# EAGLE design LE (EAGLE 7.2.0)

## Sheet 1 of 5
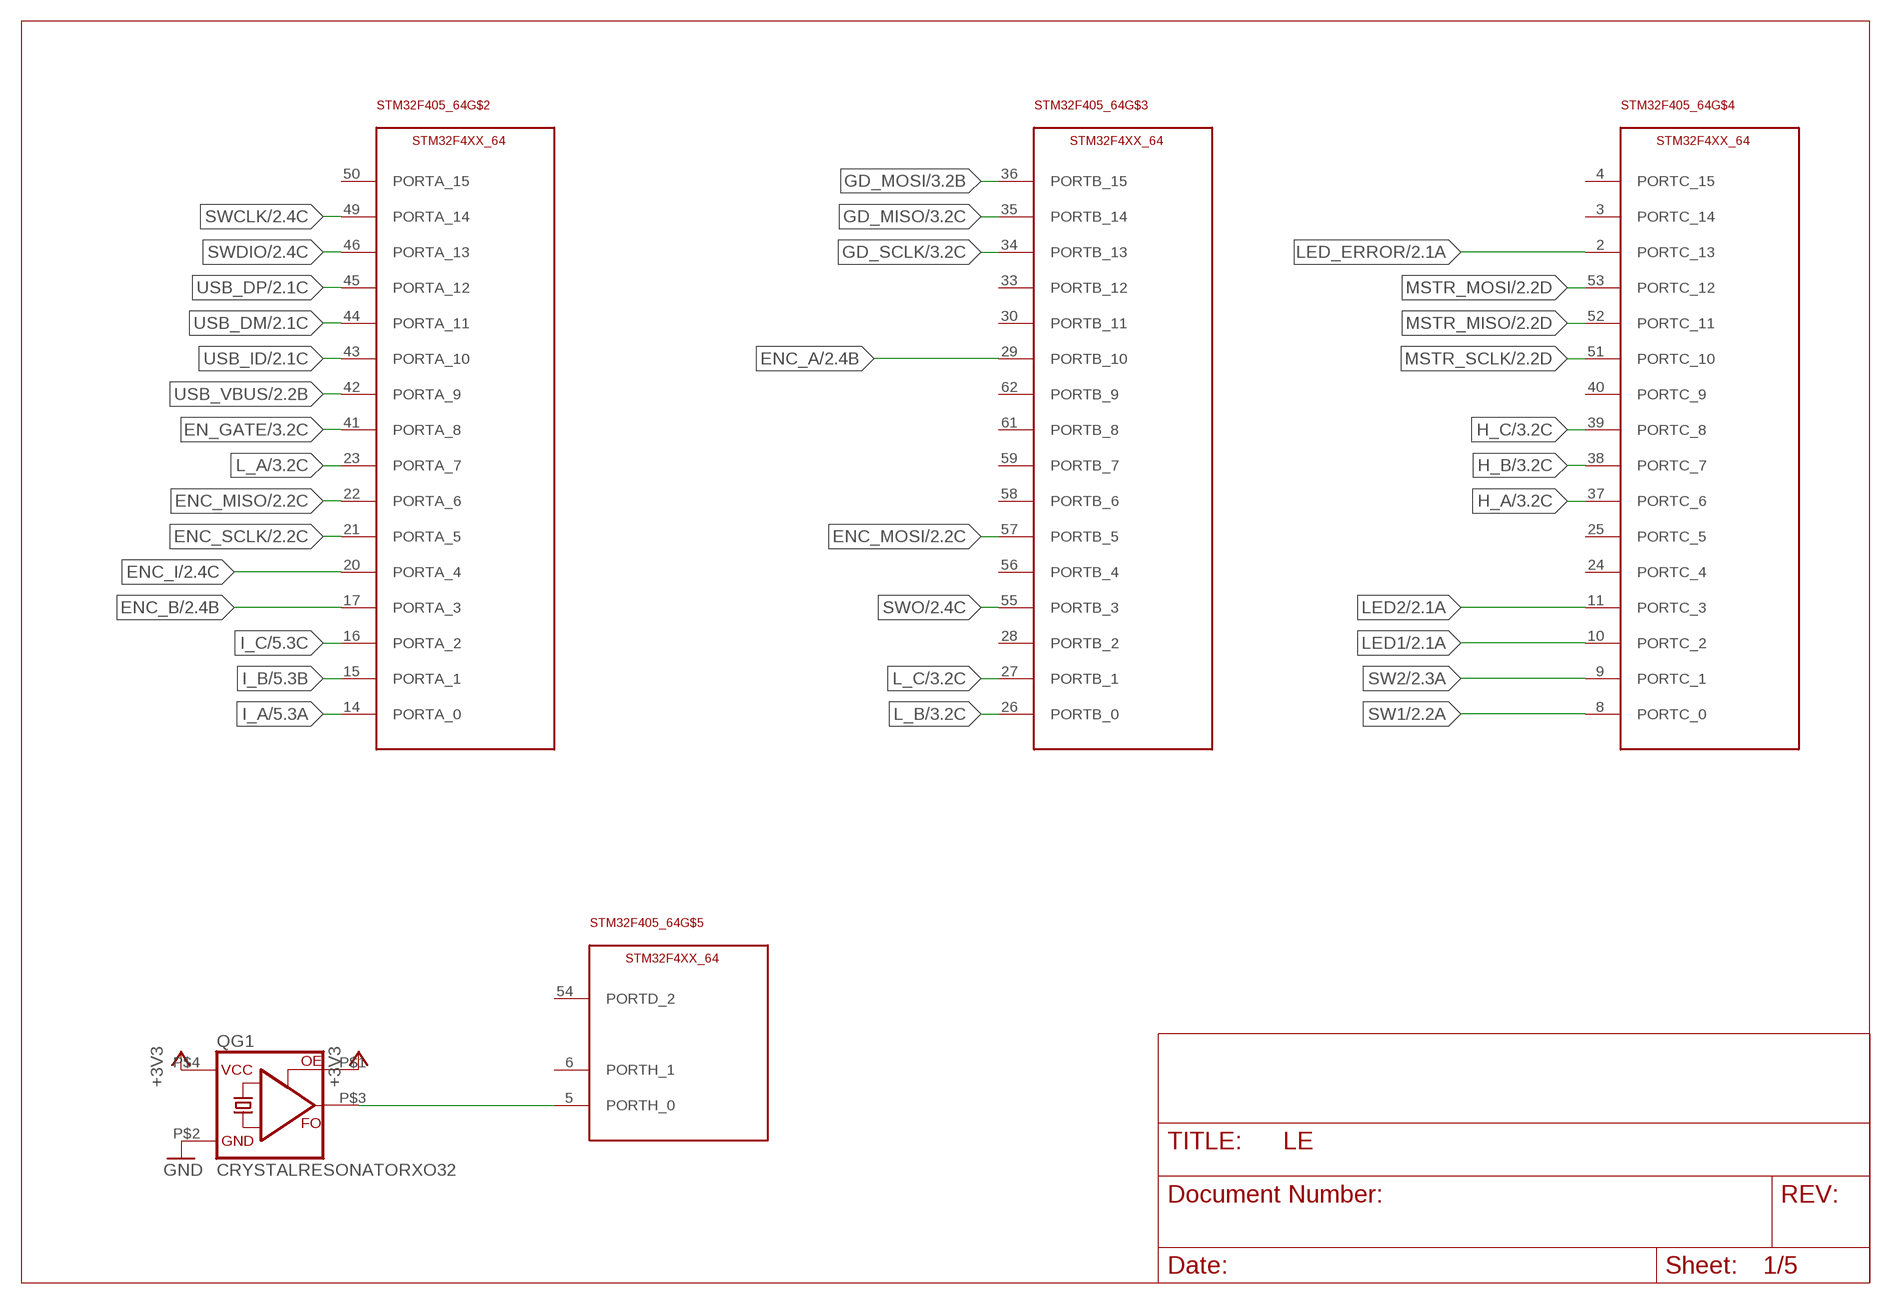
[diagram p0: schematic, sheet 1]

### Parts
QG1  CRYSTALRESONATORXO32  [XO32]
STM32F405_64  STM32F4XX_64  [TQFP64]

### Nets
+3V3: QG1.P$1(OE) QG1.P$4(VCC) ; also sheet 2,3
EN_GATE: STM32F405_64.41(PORTA_8) ; also sheet 3
ENC_A: STM32F405_64.29(PORTB_10) ; also sheet 2
ENC_B: STM32F405_64.17(PORTA_3) ; also sheet 2
ENC_I: STM32F405_64.20(PORTA_4) ; also sheet 2
ENC_MISO: STM32F405_64.22(PORTA_6) ; also sheet 2
ENC_MOSI: STM32F405_64.57(PORTB_5) ; also sheet 2
ENC_SCLK: STM32F405_64.21(PORTA_5) ; also sheet 2
GD_MISO: STM32F405_64.35(PORTB_14) ; also sheet 3
GD_MOSI: STM32F405_64.36(PORTB_15) ; also sheet 3
GD_SCLK: STM32F405_64.34(PORTB_13) ; also sheet 3
GND: QG1.P$2(GND) ; also sheet 2,3,4,5
H_A: STM32F405_64.37(PORTC_6) ; also sheet 3
H_B: STM32F405_64.38(PORTC_7) ; also sheet 3
H_C: STM32F405_64.39(PORTC_8) ; also sheet 3
I_A: STM32F405_64.14(PORTA_0) ; also sheet 5
I_B: STM32F405_64.15(PORTA_1) ; also sheet 5
I_C: STM32F405_64.16(PORTA_2) ; also sheet 5
L_A: STM32F405_64.23(PORTA_7) ; also sheet 3
L_B: STM32F405_64.26(PORTB_0) ; also sheet 3
L_C: STM32F405_64.27(PORTB_1) ; also sheet 3
LED1: STM32F405_64.10(PORTC_2) ; also sheet 2
LED2: STM32F405_64.11(PORTC_3) ; also sheet 2
LED_ERROR: STM32F405_64.2(PORTC_13) ; also sheet 2
MSTR_MISO: STM32F405_64.52(PORTC_11) ; also sheet 2
MSTR_MOSI: STM32F405_64.53(PORTC_12) ; also sheet 2
MSTR_SCLK: STM32F405_64.51(PORTC_10) ; also sheet 2
N$30: QG1.P$3(FO) STM32F405_64.5(PORTH_0)
SW1: STM32F405_64.8(PORTC_0) ; also sheet 2
SW2: STM32F405_64.9(PORTC_1) ; also sheet 2
SWCLK: STM32F405_64.49(PORTA_14) ; also sheet 2
SWDIO: STM32F405_64.46(PORTA_13) ; also sheet 2
SWO: STM32F405_64.55(PORTB_3) ; also sheet 2
USB_DM: STM32F405_64.44(PORTA_11) ; also sheet 2
USB_DP: STM32F405_64.45(PORTA_12) ; also sheet 2
USB_ID: STM32F405_64.43(PORTA_10) ; also sheet 2
USB_VBUS: STM32F405_64.42(PORTA_9) ; also sheet 2
Unconnected: STM32F405_64.3(PORTC_14) STM32F405_64.4(PORTC_15) STM32F405_64.6(PORTH_1) STM32F405_64.24(PORTC_4) STM32F405_64.25(PORTC_5) STM32F405_64.28(PORTB_2) STM32F405_64.30(PORTB_11) STM32F405_64.33(PORTB_12) STM32F405_64.40(PORTC_9) STM32F405_64.50(PORTA_15) STM32F405_64.54(PORTD_2) STM32F405_64.56(PORTB_4) STM32F405_64.58(PORTB_6) STM32F405_64.59(PORTB_7) STM32F405_64.61(PORTB_8) STM32F405_64.62(PORTB_9)

## Sheet 2 of 5
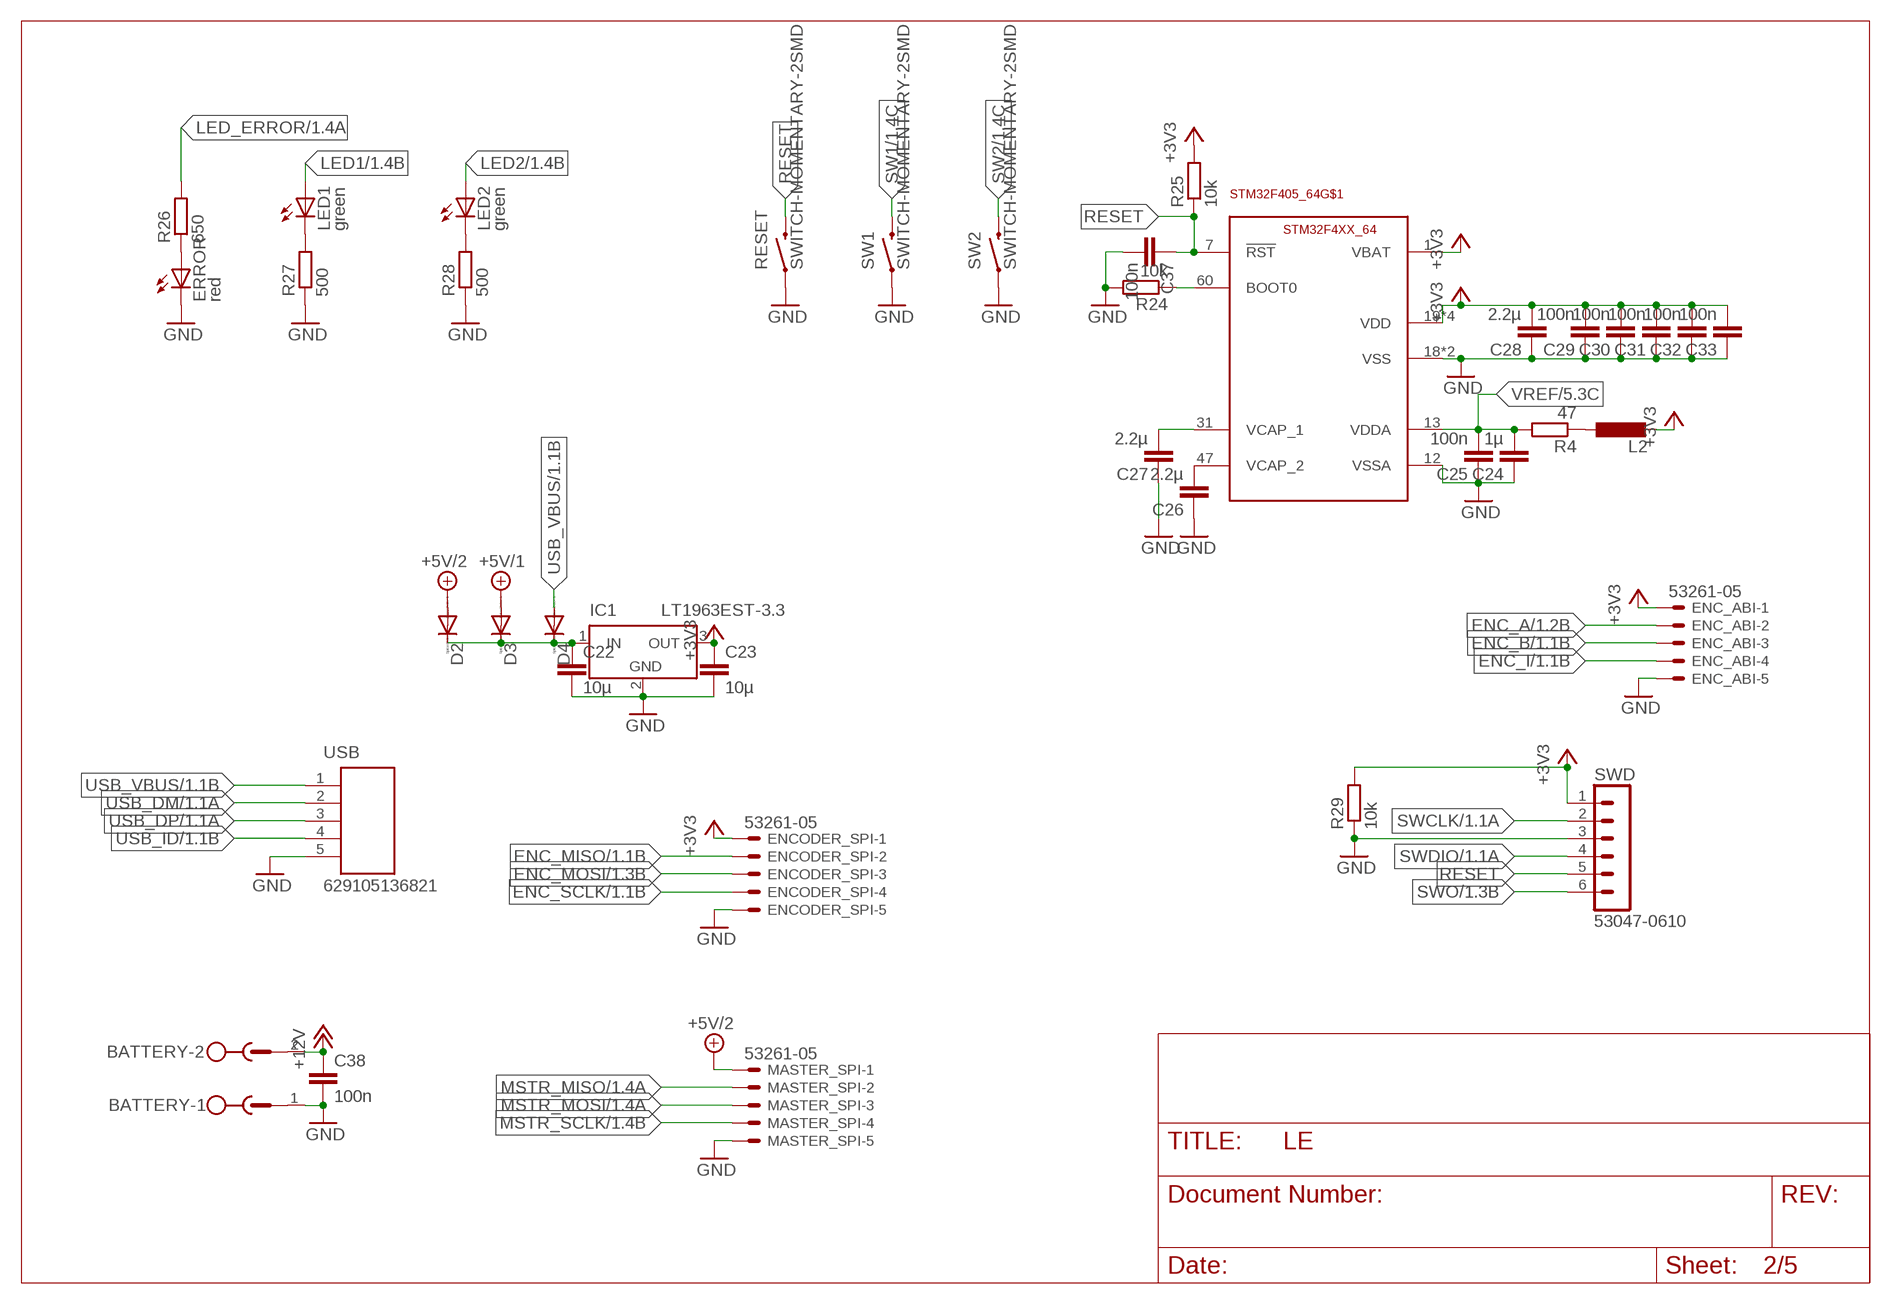
[diagram p1: schematic, sheet 2]

### Parts
BATTERY  MSTBV2  [MSTBV2]
C22  10µ  C-EUC0805  [C0805]
C23  10µ  C-EUC0805  [C0805]
C24  1µ  C-EUC0805  [C0805]
C25  100n  C-EUC0805  [C0805]
C26  2.2µ  C-EUC0805  [C0805]
C27  2.2µ  C-EUC0805  [C0805]
C28  2.2µ  C-EUC0805  [C0805]
C29  100n  C-EUC0805  [C0805]
C30  100n  C-EUC0805  [C0805]
C31  100n  C-EUC0805  [C0805]
C32  100n  C-EUC0805  [C0805]
C33  100n  C-EUC0805  [C0805]
C37  100n  C-EUC0805  [C0805]
C38  100n  C-EUC0805  [C0805]
D2  DIODE-DO214AC  [DO214AC]
D3  DIODE-DO214AC  [DO214AC]
D4  DIODE-DO214AC  [DO214AC]
ENC_ABI  53261-05  [53261-05]
ENCODER_SPI  53261-05  [53261-05]
ERROR  red  LEDCHIP-LED0805  [CHIP-LED0805]
IC1  LT1963EST-3.3  [SOT223]
L2  L-EUL2012C  [L2012C]
LED1  green  LEDCHIP-LED0805  [CHIP-LED0805]
LED2  green  LEDCHIP-LED0805  [CHIP-LED0805]
MASTER_SPI  53261-05  [53261-05]
R4  47  R-EU_R0805  [R0805]
R24  10k  R-EU_R0805  [R0805]
R25  10k  R-EU_R0805  [R0805]
R26  650  R-EU_R0805  [R0805]
R27  500  R-EU_R0805  [R0805]
R28  500  R-EU_R0805  [R0805]
R29  10k  R-EU_R0805  [R0805]
RESET  SWITCH-MOMENTARY-2SMD  [TACTILE-SWITCH-SMD]
SW1  SWITCH-MOMENTARY-2SMD  [TACTILE-SWITCH-SMD]
SW2  SWITCH-MOMENTARY-2SMD  [TACTILE-SWITCH-SMD]
SWD  53047-0610  [53047-0610]
USB  629105136821  [629105136821]

### Nets
+3V3: C23.1 C28.2 C29.2 C30.2 C31.2 C32.2 C33.2 ENC_ABI.1 ENCODER_SPI.1 IC1.3(OUT) L2.2 R25.2 R29.2 STM32F405_64.1(VBAT) STM32F405_64.19(VDD) STM32F405_64.32(VDD) STM32F405_64.48(VDD) STM32F405_64.64(VDD) SWD.1 ; also sheet 1,3
+5V/1: D3.A ; also sheet 3
+5V/2: D2.A MASTER_SPI.1
+12V: BATTERY.2 C38.1 ; also sheet 3,4
ENC_A: ENC_ABI.2 ; also sheet 1
ENC_B: ENC_ABI.3 ; also sheet 1
ENC_I: ENC_ABI.4 ; also sheet 1
ENC_MISO: ENCODER_SPI.2 ; also sheet 1
ENC_MOSI: ENCODER_SPI.3 ; also sheet 1
ENC_SCLK: ENCODER_SPI.4 ; also sheet 1
GND: BATTERY.1 C22.2 C23.2 C24.1 C25.1 C26.1 C27.1 C28.1 C29.1 C30.1 C31.1 C32.1 C33.1 C37.2 C38.2 ENC_ABI.5 ENCODER_SPI.5 ERROR.C IC1.2(GND) MASTER_SPI.5 R24.2 R27.1 R28.1 R29.1 RESET.1 STM32F405_64.12(VSSA) STM32F405_64.18(VSS) STM32F405_64.63(VSS) SW1.1 SW2.1 SWD.3 USB.5 ; also sheet 1,3,4,5
LED1: LED1.A ; also sheet 1
LED2: LED2.A ; also sheet 1
LED_ERROR: R26.2 ; also sheet 1
MSTR_MISO: MASTER_SPI.2 ; also sheet 1
MSTR_MOSI: MASTER_SPI.3 ; also sheet 1
MSTR_SCLK: MASTER_SPI.4 ; also sheet 1
N$1: L2.1 R4.1
N$3: C26.2 STM32F405_64.47(VCAP_2)
N$4: C27.2 STM32F405_64.31(VCAP_1)
N$7: LED1.C R27.2
N$8: C22.1 D2.C D3.C D4.C IC1.1(IN)
N$28: LED2.C R28.2
N$31: R24.1 STM32F405_64.60(BOOT0)
N$33: ERROR.A R26.1
RESET: C37.1 R25.1 RESET.3 STM32F405_64.7(!RST) SWD.5
SW1: SW1.3 ; also sheet 1
SW2: SW2.3 ; also sheet 1
SWCLK: SWD.2 ; also sheet 1
SWDIO: SWD.4 ; also sheet 1
SWO: SWD.6 ; also sheet 1
USB_DM: USB.2 ; also sheet 1
USB_DP: USB.3 ; also sheet 1
USB_ID: USB.4 ; also sheet 1
USB_VBUS: D4.A USB.1 ; also sheet 1
VREF: C24.2 C25.2 R4.2 STM32F405_64.13(VDDA) ; also sheet 5

## Sheet 3 of 5
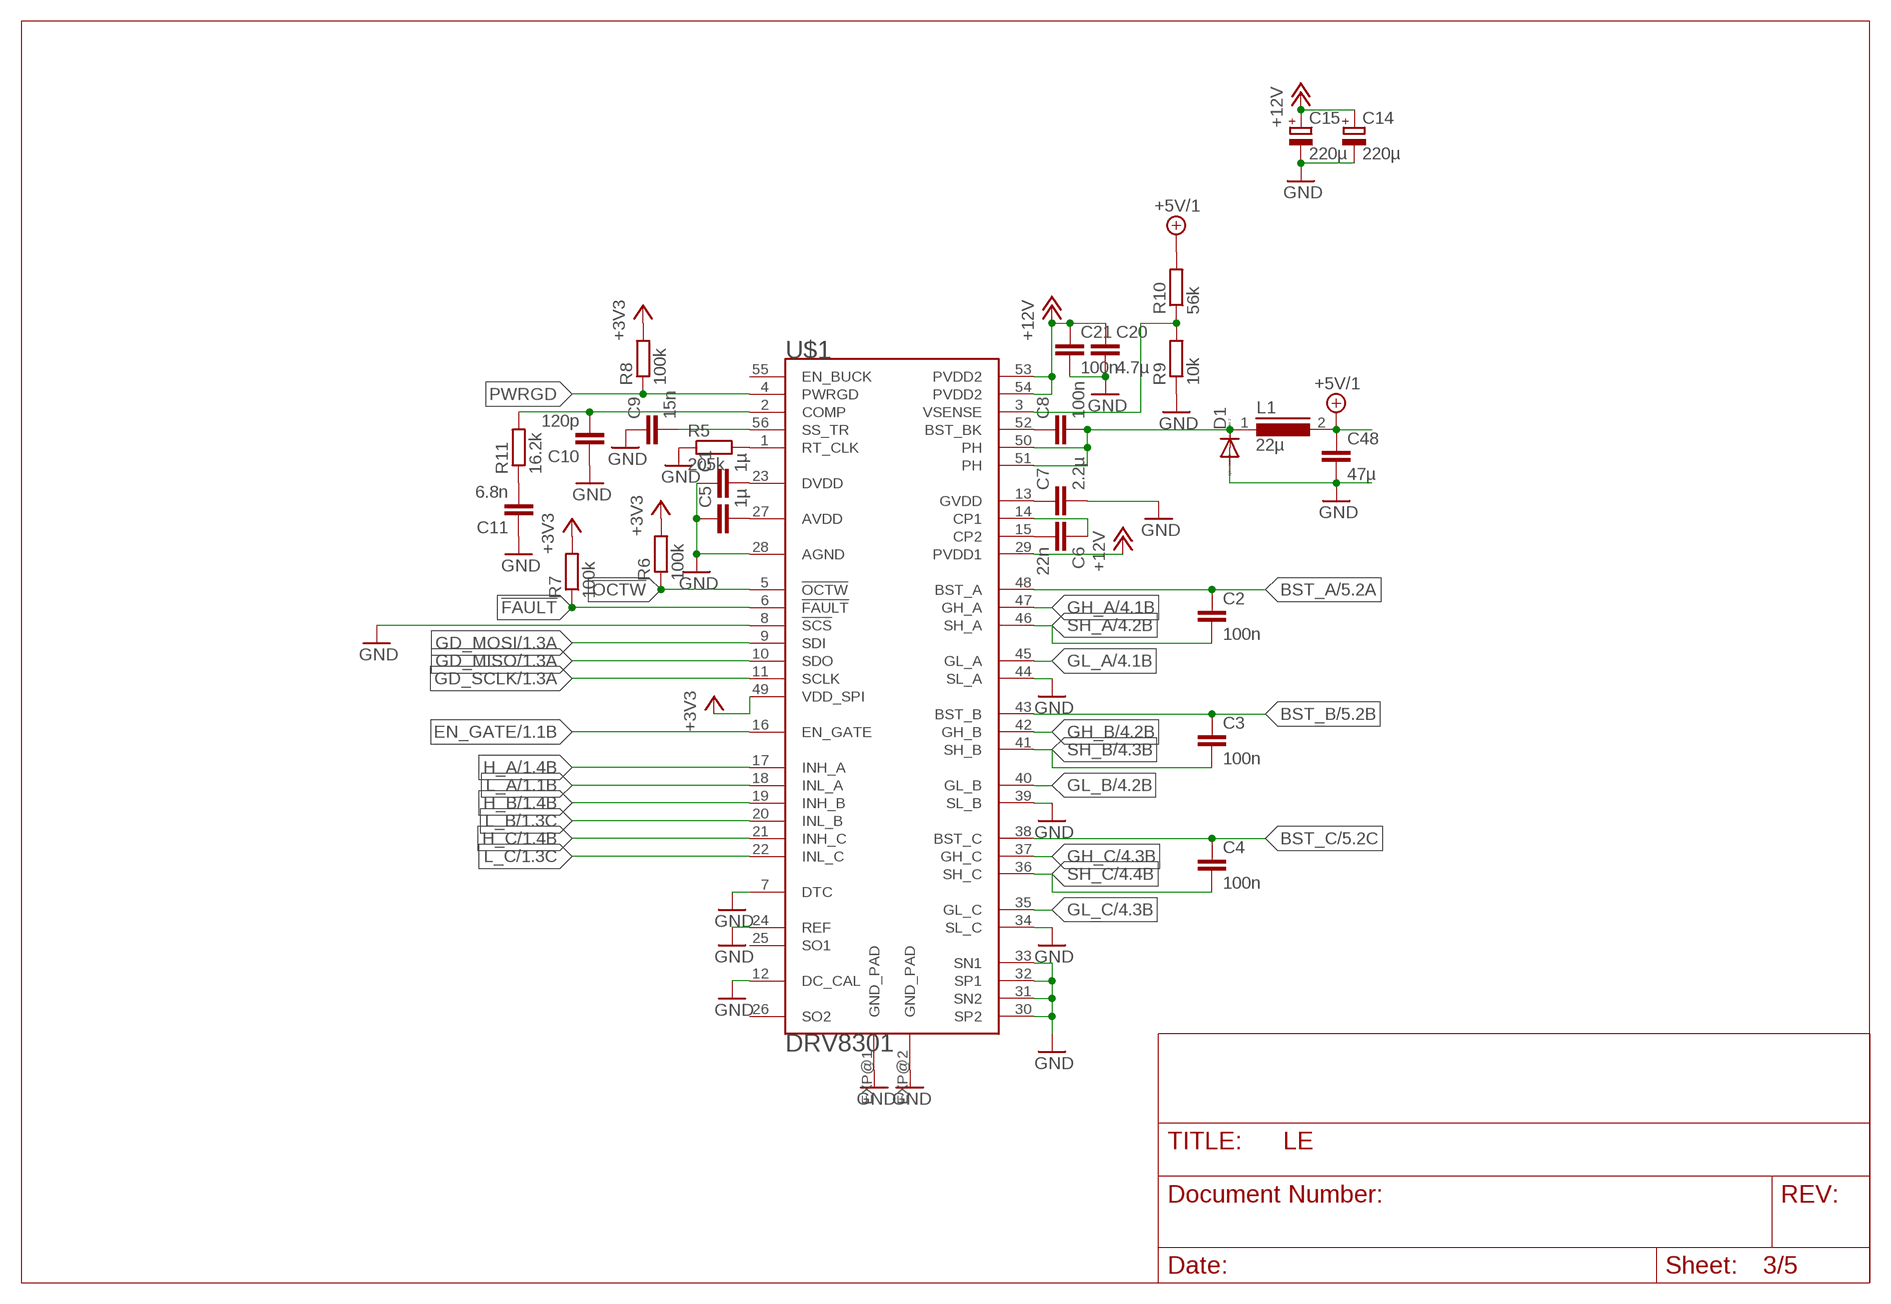
[diagram p2: schematic, sheet 3]

### Parts
C1  1µ  C-EUC0805  [C0805]
C2  100n  C-EUC0805  [C0805]
C3  100n  C-EUC0805  [C0805]
C4  100n  C-EUC0805  [C0805]
C5  1µ  C-EUC0805  [C0805]
C6  22n  C-EUC0805  [C0805]
C7  2.2µ  C-EUC0805  [C0805]
C8  100n  C-EUC0805  [C0805]
C9  15n  C-EUC0805  [C0805]
C10  120p  C-EUC0805  [C0805]
C11  6.8n  C-EUC0805  [C0805]
C14  220µ  CPOL-EUG  [PANASONIC_G]
C15  220µ  CPOL-EUG  [PANASONIC_G]
C20  4.7µ  C-EUC0805  [C0805]
C21  100n  C-EUC0805  [C0805]
C48  47µ  C-EUC1206  [C1206]
D1  DIODE-DO-214AC  [DO-214AC]
L1  22µ  DR127  [DR127]
R5  205k  R-EU_R0805  [R0805]
R6  100k  R-EU_R0805  [R0805]
R7  100k  R-EU_R0805  [R0805]
R8  100k  R-EU_R0805  [R0805]
R9  10k  R-EU_R0805  [R0805]
R10  56k  R-EU_R0805  [R0805]
R11  16.2k  R-EU_R0805  [R0805]
U$1  DRV8301  [HTSSOP56DCA]

### Nets
!FAULT: R7.1 U$1.6(!FAULT)
!OCTW: R6.1 U$1.5(!OCTW)
+3V3: R6.2 R7.2 R8.2 U$1.49(VDD_SPI) ; also sheet 1,2
+5V/1: C48.1 L1.2 R10.2 ; also sheet 2
+12V: C14.+ C15.+ C20.1 C21.1 U$1.29(PVDD1) U$1.53(PVDD2) U$1.54(PVDD2) ; also sheet 2,4
BST_A: C2.1 U$1.48(BST_A) ; also sheet 5
BST_B: C3.1 U$1.43(BST_B) ; also sheet 5
BST_C: C4.1 U$1.38(BST_C) ; also sheet 5
EN_GATE: U$1.16(EN_GATE) ; also sheet 1
GD_MISO: U$1.10(SDO) ; also sheet 1
GD_MOSI: U$1.9(SDI) ; also sheet 1
GD_SCLK: U$1.11(SCLK) ; also sheet 1
GH_A: U$1.47(GH_A) ; also sheet 4
GH_B: U$1.42(GH_B) ; also sheet 4
GH_C: U$1.37(GH_C) ; also sheet 4
GL_A: U$1.45(GL_A) ; also sheet 4
GL_B: U$1.40(GL_B) ; also sheet 4
GL_C: U$1.35(GL_C) ; also sheet 4
GND: C1.1 C5.1 C7.2 C9.1 C10.1 C11.1 C14.- C15.- C20.2 C21.2 C48.2 D1.A R5.1 R9.1 U$1.7(DTC) U$1.8(!SCS) U$1.12(DC_CAL) U$1.24(REF) U$1.28(AGND) U$1.30(SP2) U$1.31(SN2) U$1.32(SP1) U$1.33(SN1) U$1.34(SL_C) U$1.39(SL_B) U$1.44(SL_A) U$1.EXP@1(GND_PAD) U$1.EXP@2(GND_PAD) ; also sheet 1,2,4,5
H_A: U$1.17(INH_A) ; also sheet 1
H_B: U$1.19(INH_B) ; also sheet 1
H_C: U$1.21(INH_C) ; also sheet 1
L_A: U$1.18(INL_A) ; also sheet 1
L_B: U$1.20(INL_B) ; also sheet 1
L_C: U$1.22(INL_C) ; also sheet 1
N$9: R5.2 U$1.1(RT_CLK)
N$10: C1.2 U$1.23(DVDD)
N$11: C5.2 U$1.27(AVDD)
N$12: C6.1 U$1.14(CP1)
N$13: C6.2 U$1.15(CP2)
N$14: C7.1 U$1.13(GVDD)
N$15: C8.1 U$1.52(BST_BK)
N$16: C8.2 D1.C L1.1 U$1.50(PH) U$1.51(PH)
N$17: C9.2 U$1.56(SS_TR)
N$18: R9.2 R10.1 U$1.3(VSENSE)
N$19: C11.2 R11.1
N$20: C10.2 R11.2 U$1.2(COMP)
PWRGD: R8.1 U$1.4(PWRGD)
SH_A: C2.2 U$1.46(SH_A) ; also sheet 4,5
SH_B: C3.2 U$1.41(SH_B) ; also sheet 4,5
SH_C: C4.2 U$1.36(SH_C) ; also sheet 4,5
Unconnected: U$1.25(SO1) U$1.26(SO2) U$1.55(EN_BUCK)

## Sheet 4 of 5
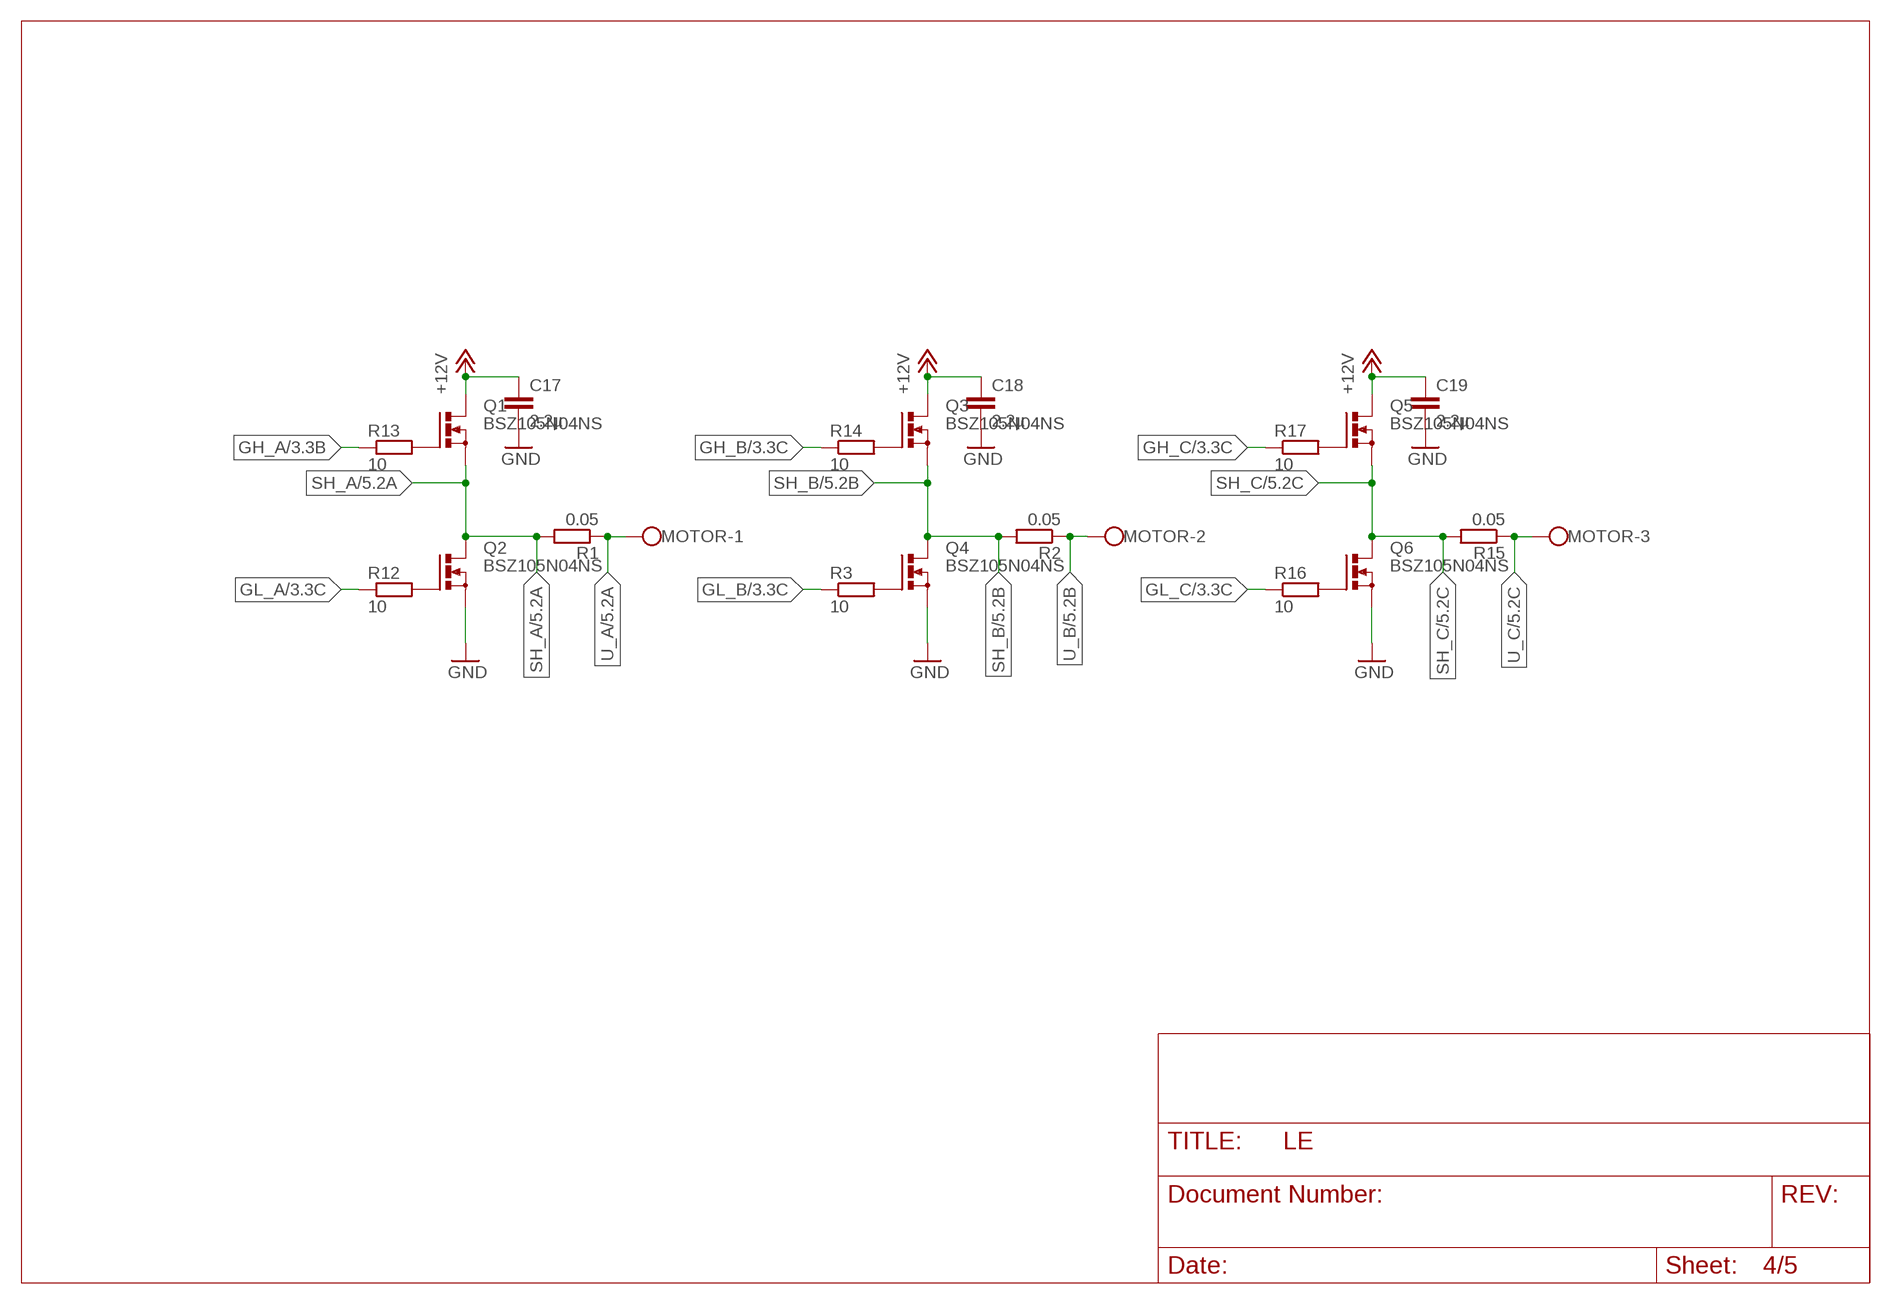
[diagram p3: schematic, sheet 4]

### Parts
C17  2.2µ  C-EUC0805  [C0805]
C18  2.2µ  C-EUC0805  [C0805]
C19  2.2µ  C-EUC0805  [C0805]
MOTOR  W237-103  [W237-103]
Q1  BSZ105N04NS  [PG-TDSON-8]
Q2  BSZ105N04NS  [PG-TDSON-8]
Q3  BSZ105N04NS  [PG-TDSON-8]
Q4  BSZ105N04NS  [PG-TDSON-8]
Q5  BSZ105N04NS  [PG-TDSON-8]
Q6  BSZ105N04NS  [PG-TDSON-8]
R1  0.05  R-EU_R1206  [R1206]
R2  0.05  R-EU_R1206  [R1206]
R3  10  R-EU_R1206  [R1206]
R12  10  R-EU_R1206  [R1206]
R13  10  R-EU_R0805  [R0805]
R14  10  R-EU_R0805  [R0805]
R15  0.05  R-EU_R1206  [R1206]
R16  10  R-EU_R1206  [R1206]
R17  10  R-EU_R0805  [R0805]

### Nets
+12V: C17.1 C18.1 C19.1 Q1.5(D) Q1.6(D) Q1.7(D) Q1.8(D) Q1.TH(D) Q3.5(D) Q3.6(D) Q3.7(D) Q3.8(D) Q3.TH(D) Q5.5(D) Q5.6(D) Q5.7(D) Q5.8(D) Q5.TH(D) ; also sheet 2,3
GH_A: R13.1 ; also sheet 3
GH_B: R14.1 ; also sheet 3
GH_C: R17.1 ; also sheet 3
GL_A: R12.1 ; also sheet 3
GL_B: R3.1 ; also sheet 3
GL_C: R16.1 ; also sheet 3
GND: C17.2 C18.2 C19.2 Q2.1(S) Q2.2(S) Q2.3(S) Q4.1(S) Q4.2(S) Q4.3(S) Q6.1(S) Q6.2(S) Q6.3(S) ; also sheet 1,2,3,5
N$6: Q3.4(G) R14.2
N$21: Q1.4(G) R13.2
N$22: Q4.4(G) R3.2
N$24: Q5.4(G) R17.2
N$25: Q6.4(G) R16.2
N$26: Q2.4(G) R12.2
SH_A: Q1.1(S) Q1.2(S) Q1.3(S) Q2.5(D) Q2.6(D) Q2.7(D) Q2.8(D) Q2.TH(D) R1.2 ; also sheet 3,5
SH_B: Q3.1(S) Q3.2(S) Q3.3(S) Q4.5(D) Q4.6(D) Q4.7(D) Q4.8(D) Q4.TH(D) R2.2 ; also sheet 3,5
SH_C: Q5.1(S) Q5.2(S) Q5.3(S) Q6.5(D) Q6.6(D) Q6.7(D) Q6.8(D) Q6.TH(D) R15.2 ; also sheet 3,5
U_A: MOTOR.1 R1.1 ; also sheet 5
U_B: MOTOR.2 R2.1 ; also sheet 5
U_C: MOTOR.3 R15.1 ; also sheet 5

## Sheet 5 of 5
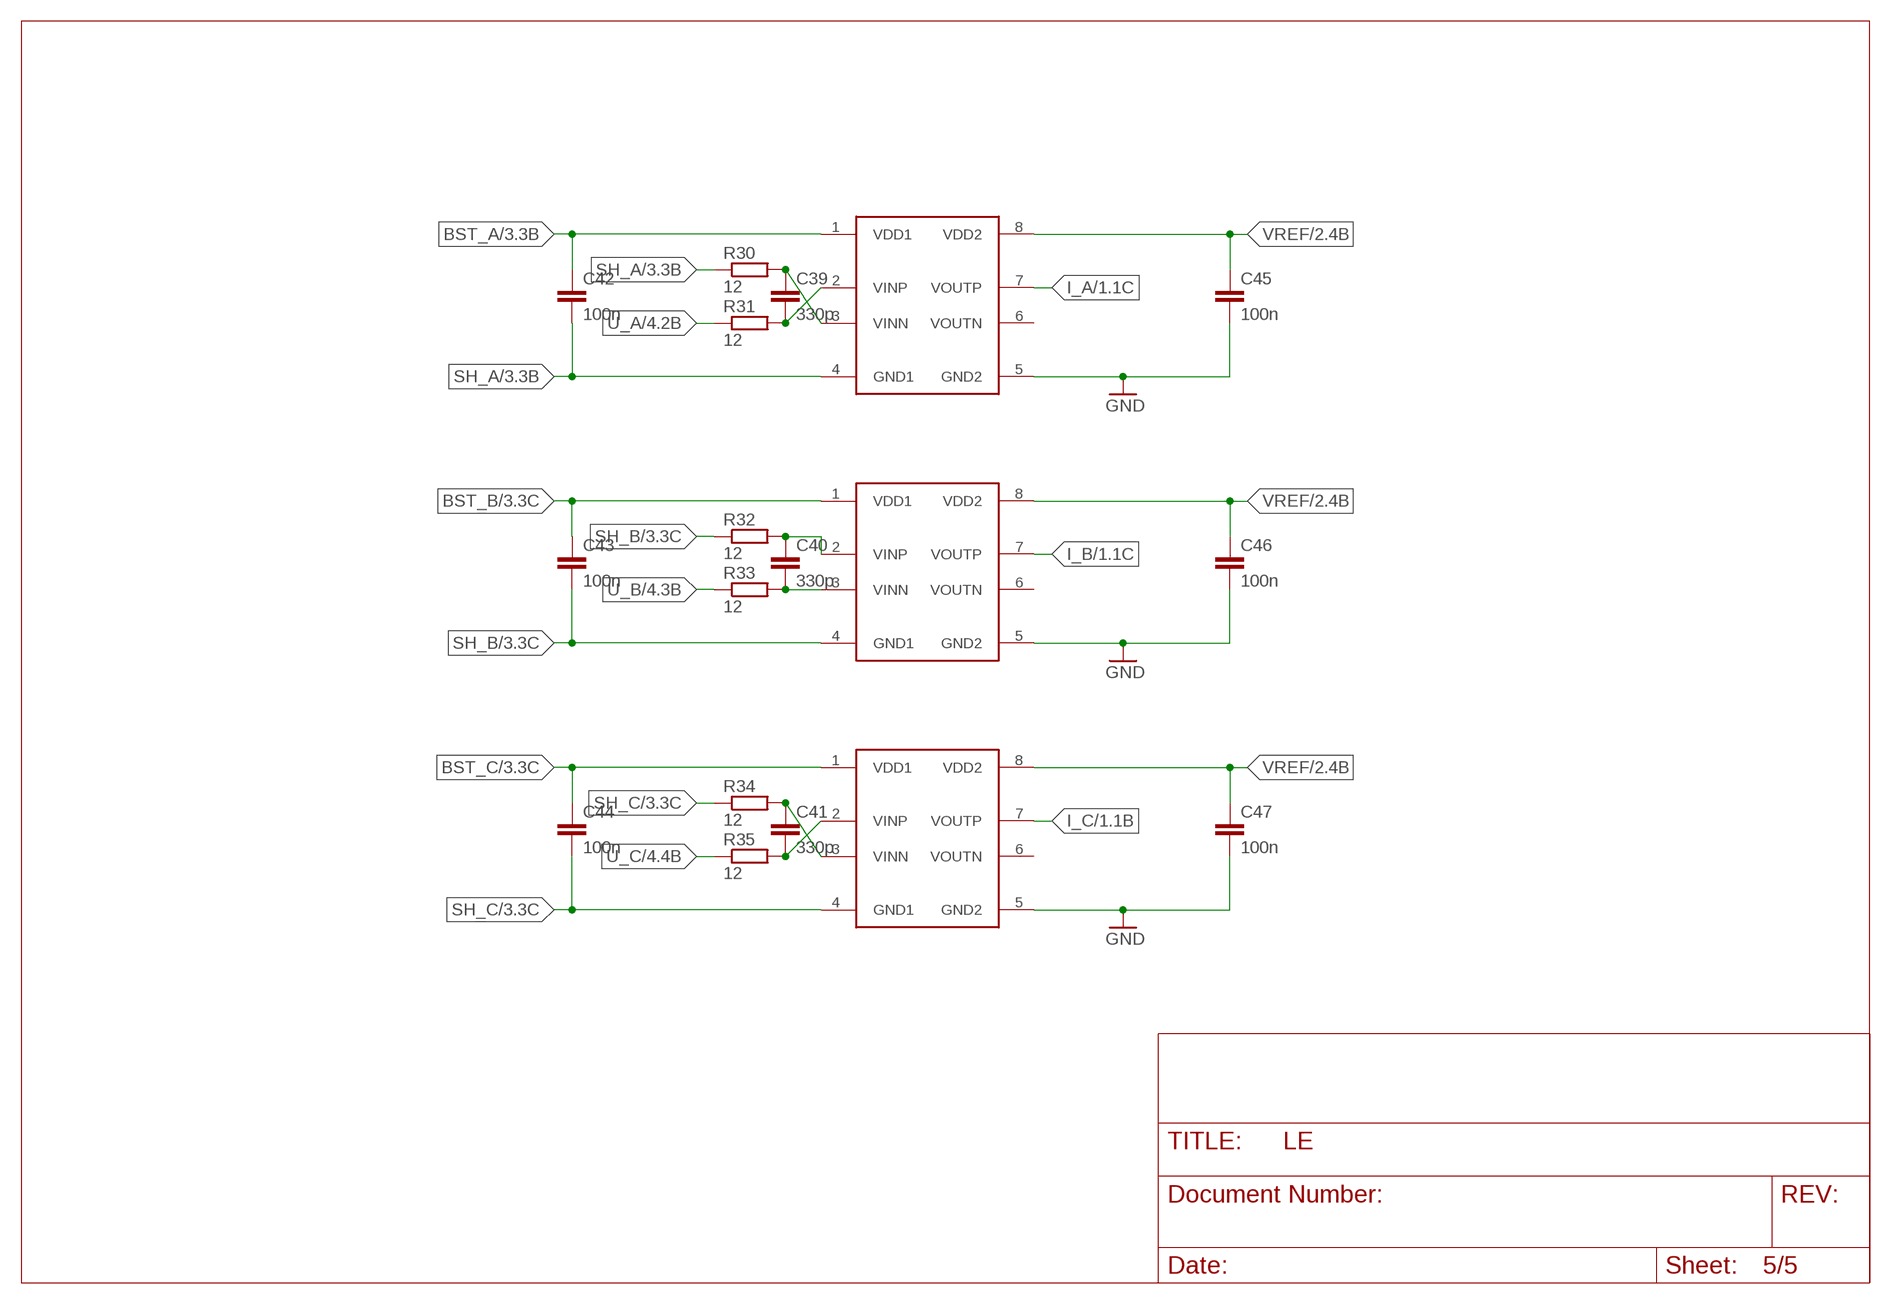
[diagram p4: schematic, sheet 5]

### Parts
C39  330p  C-EUC0805  [C0805]
C40  330p  C-EUC0805  [C0805]
C41  330p  C-EUC0805  [C0805]
C42  100n  C-EUC1206  [C1206]
C43  100n  C-EUC1206  [C1206]
C44  100n  C-EUC1206  [C1206]
C45  100n  C-EUC1206  [C1206]
C46  100n  C-EUC1206  [C1206]
C47  100n  C-EUC1206  [C1206]
R30  12  R-EU_R0805  [R0805]
R31  12  R-EU_R0805  [R0805]
R32  12  R-EU_R0805  [R0805]
R33  12  R-EU_R0805  [R0805]
R34  12  R-EU_R0805  [R0805]
R35  12  R-EU_R0805  [R0805]
U$2  AMC1200  [SOIC8]
U$3  AMC1200  [SOIC8]
U$4  AMC1200  [SOIC8]

### Nets
BST_A: C42.1 U$2.1(VDD1) ; also sheet 3
BST_B: C43.1 U$3.1(VDD1) ; also sheet 3
BST_C: C44.1 U$4.1(VDD1) ; also sheet 3
GND: C45.2 C46.2 C47.2 U$2.5(GND2) U$3.5(GND2) U$4.5(GND2) ; also sheet 1,2,3,4
I_A: U$2.7(VOUTP) ; also sheet 1
I_B: U$3.7(VOUTP) ; also sheet 1
I_C: U$4.7(VOUTP) ; also sheet 1
N$27: C39.1 R30.2 U$2.3(VINN)
N$32: C39.2 R31.2 U$2.2(VINP)
N$37: C40.2 R33.2 U$3.3(VINN)
N$38: C40.1 R32.2 U$3.2(VINP)
N$39: C41.1 R34.2 U$4.3(VINN)
N$40: C41.2 R35.2 U$4.2(VINP)
SH_A: C42.2 R30.1 U$2.4(GND1) ; also sheet 3,4
SH_B: C43.2 R32.1 U$3.4(GND1) ; also sheet 3,4
SH_C: C44.2 R34.1 U$4.4(GND1) ; also sheet 3,4
U_A: R31.1 ; also sheet 4
U_B: R33.1 ; also sheet 4
U_C: R35.1 ; also sheet 4
VREF: C45.1 C46.1 C47.1 U$2.8(VDD2) U$3.8(VDD2) U$4.8(VDD2) ; also sheet 2
Unconnected: U$2.6(VOUTN) U$3.6(VOUTN) U$4.6(VOUTN)

## Power pins joined to a net without a drawn wire
GND: IC1.4(GND)

## Library data of the parts
BATTERY = con-phoenix-500:MSTBV2: PHOENIX; OC_FARNELL: unknown; OC_NEWARK: unknown
C1-C11 C17-C33 C37-C48 = rcl:C-EU: CAPACITOR, European symbol
C14 C15 = rcl:CPOL-EU: POLARIZED CAPACITOR, European symbol
D1-D4 = diode:DIODE-: DIODE
ENC_ABI ENCODER_SPI MASTER_SPI = con-molex:53?-05: CONNECTOR wire to board 1.25 mm (.049 inch) pitch header; OC_FARNELL: 1433644; OC_NEWARK: unknown
ERROR LED1 LED2 = led:LED: LED OSRAM: - CHIPLED LG R971, LG N971, LY N971, LG Q971, LY Q971, LO R971, LY R971 LH N974, LH R974 LS Q976, LO Q976, LY Q976 LO Q996 - Hyper CHIPLED LW Q18S LB Q993, LB Q99A, LB R99A - SideLED LS A670, LO A670, LY A670, LG A670, LP A670 LB A673, LV A673, LT A673, LW A673 LH A674 LY A675 LS A676, LA A676, LO A676, LY A676, LW A676 LS A679, LY A679, LG A679 - Hyper Micro SIDELED® LS Y876, LA Y876, LO Y876, LY Y876 LT Y87S - SmartLED LW L88C, LW L88S LB L89C, LB L89S, LG L890 LS L89K, LO L89K, LY L89K LS L896, LA L896, LO L896, LY L896 - TOPLED LS T670, LO T670, LY T670, LG T670, LP T670 LSG T670, LSP T670, LSY T670, LOP T670, LYG T670 LG T671, LOG T671, LSG T671 LB T673, LV T673, LT T673, LW T673 LH T674 LS T676, LA T676, LO T676, LY T676, LB T676, LH T676, LSB T676, LW T676 LB T67C, LV T67C, LT T67C, LS T67K, LO T67K, LY T67K, LW E67C LS E67B, LA E67B, LO E67B, LY E67B, LB E67C, LV E67C, LT E67C LW T67C LS T679, LY T679, LG T679 LS T770, LO T770, LY T770, LG T770, LP T770 LB T773, LV T773, LT T773, LW T773 LH T774 LS E675, LA E675, LY E675, LS T675 LS T776, LA T776, LO T776, LY T776, LB T776 LHGB T686 LT T68C, LB T68C - Hyper Mini TOPLED® LB M676 - Mini TOPLED Santana® LG M470 LS M47K, LO M47K, LY M47K Source: http://www.osram.convergy.de LUXEON: - LUMILED® LXK2-PW12-R00, LXK2-PW12-S00, LXK2-PW14-U00, LXK2-PW14-V00 LXK2-PM12-R00, LXK2-PM12-S00, LXK2-PM14-U00 LXK2-PE12-Q00, LXK2-PE12-R00, LXK2-PE12-S00, LXK2-PE14-T00, LXK2-PE14-U00 LXK2-PB12-K00, LXK2-PB12-L00, LXK2-PB12-M00, LXK2-PB14-N00, LXK2-PB14-P00, LXK2-PB14-Q00 LXK2-PR12-L00, LXK2-PR12-M00, LXK2-PR14-Q00, LXK2-PR14-R00 LXK2-PD12-Q00, LXK2-PD12-R00, LXK2-PD12-S00 LXK2-PH12-R00, LXK2-PH12-S00 LXK2-PL12-P00, LXK2-PL12-Q00, LXK2-PL12-R00 Source: www.luxeon.com KINGBRIGHT: KA-3528ASYC Source: www.kingbright.com
IC1 = linear-technology:LT1963EST: 1.5A, Low Noise, Fast Transient Response LDO Regulator Source: http://www.linear.com/pc/downloadDocument.do?navId=H0,C3,P2222,D3148; MPN: LT1963EST-3.3; OC_FARNELL: 1501032; OC_NEWARK: 57M7546
L1 = inductors:DR127: High Power Density, High Efficiency, Shielded Inductors Source: coiltronics_dr_series.pdf
L2 = rcl:L-EU: INDUCTOR, European symbol
MOTOR = con-wago-500:W237-103: WAGO SCREW CLAMP; MPN: 237-103; OC_FARNELL: unknown; OC_NEWARK: 18M7116
Q1-Q6 = transistor-power:BSZ105N04NS: OptiMOS (TM)3 Power-Transistor N-Channel, Normal level Source : Data sheet <http://www.infineon.com/dgdl/BSZ105N04NSG_rev1.1.pdf?folderId=db3a3043156fd5730115c7d50620107c&fileId=db3a30431689f4420116c485c67f084e>
QG1 = Crystals-new:CRYSTALRESONATOR
R1-R17 R24-R35 = rcl:R-EU_: RESISTOR, European symbol
RESET SW1 SW2 = SparkFun-Electromechanical:SWITCH-MOMENTARY-2: Various NO switches- pushbuttons, reed, etc; PROD_ID: SWCH-08247
STM32F405_64 = stm32:STM32F4XX_64
SWD = con-molex-picoblade:53047-0610: HEADER
U$1 = DRV8301:DRV8301
U$2-U$4 = AMC1200:AMC1200
USB = USBSteckverbinderWR-COM:629105136821: WR-COM SMT Horizontal 5 Contacts Micro USB Type B,5 pins=>Code : Con_I-O_COM_MicroUSB_629105136821 <http://katalog.we-online.de/media/images/eican/Con_I-O_COM_MicroUSB_629105136821_pf2.jpg> Details see: http://katalog.we-online.de/en/em/629_105_136_821 Created 2014-07-09, Karrer Zheng 2014 (C) Würth Elektronik

## Board
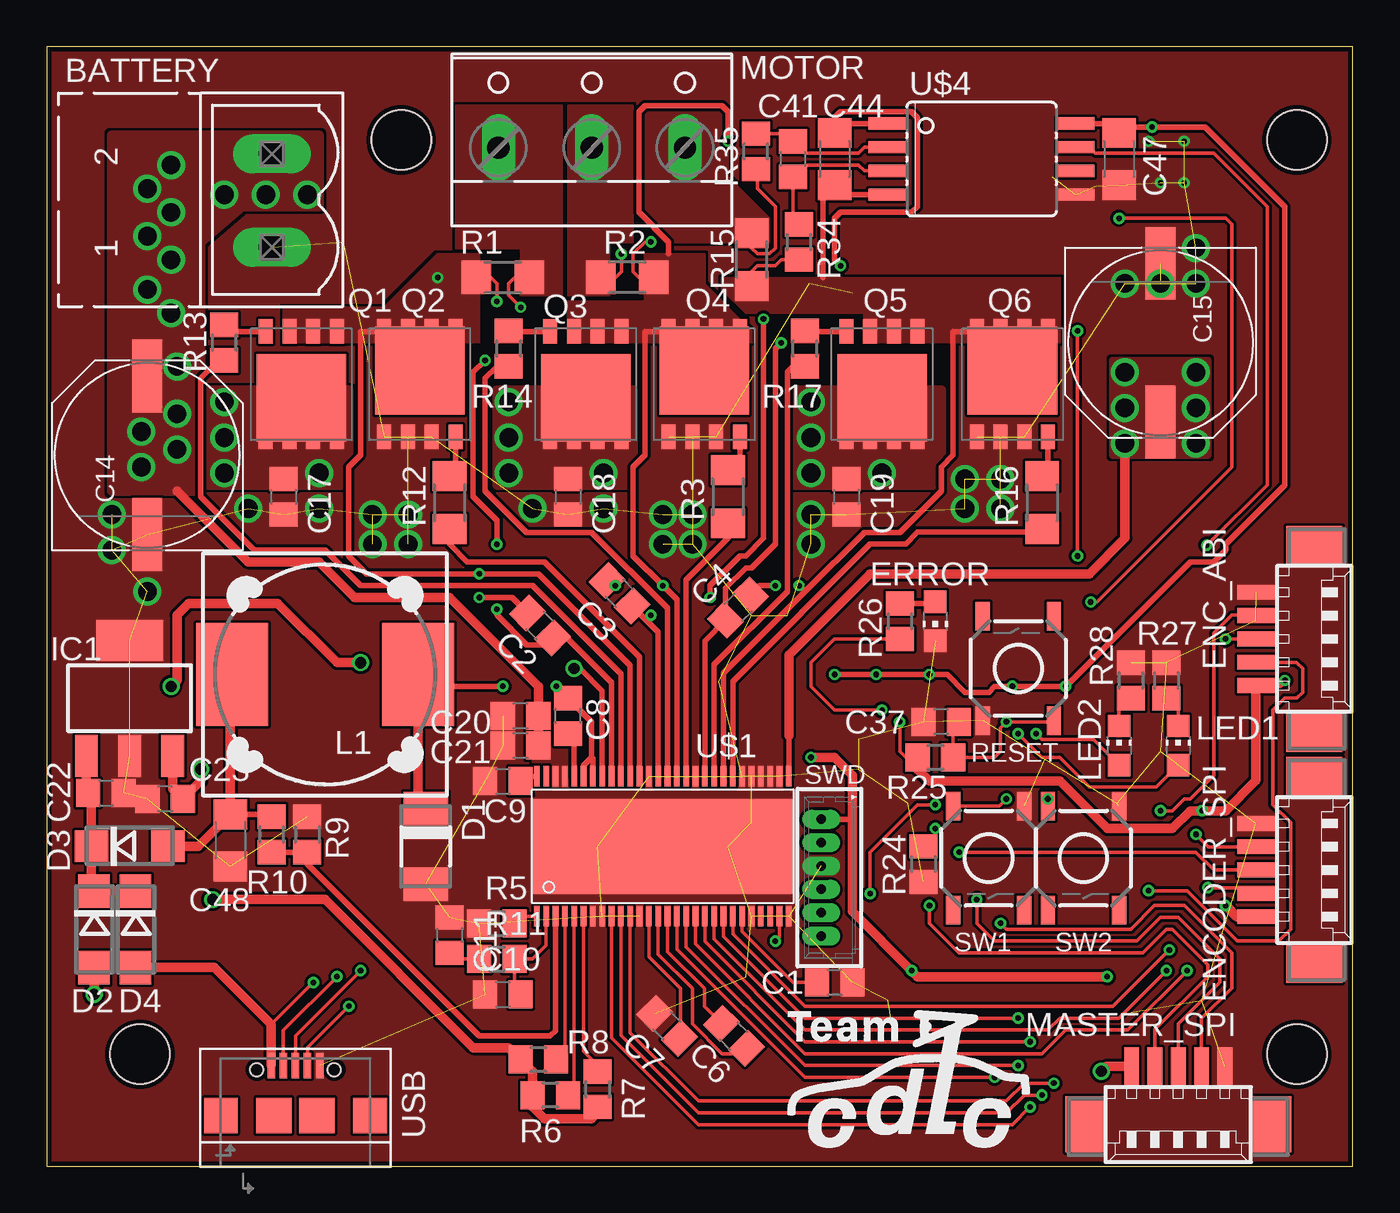
[diagram p5: board, top side]
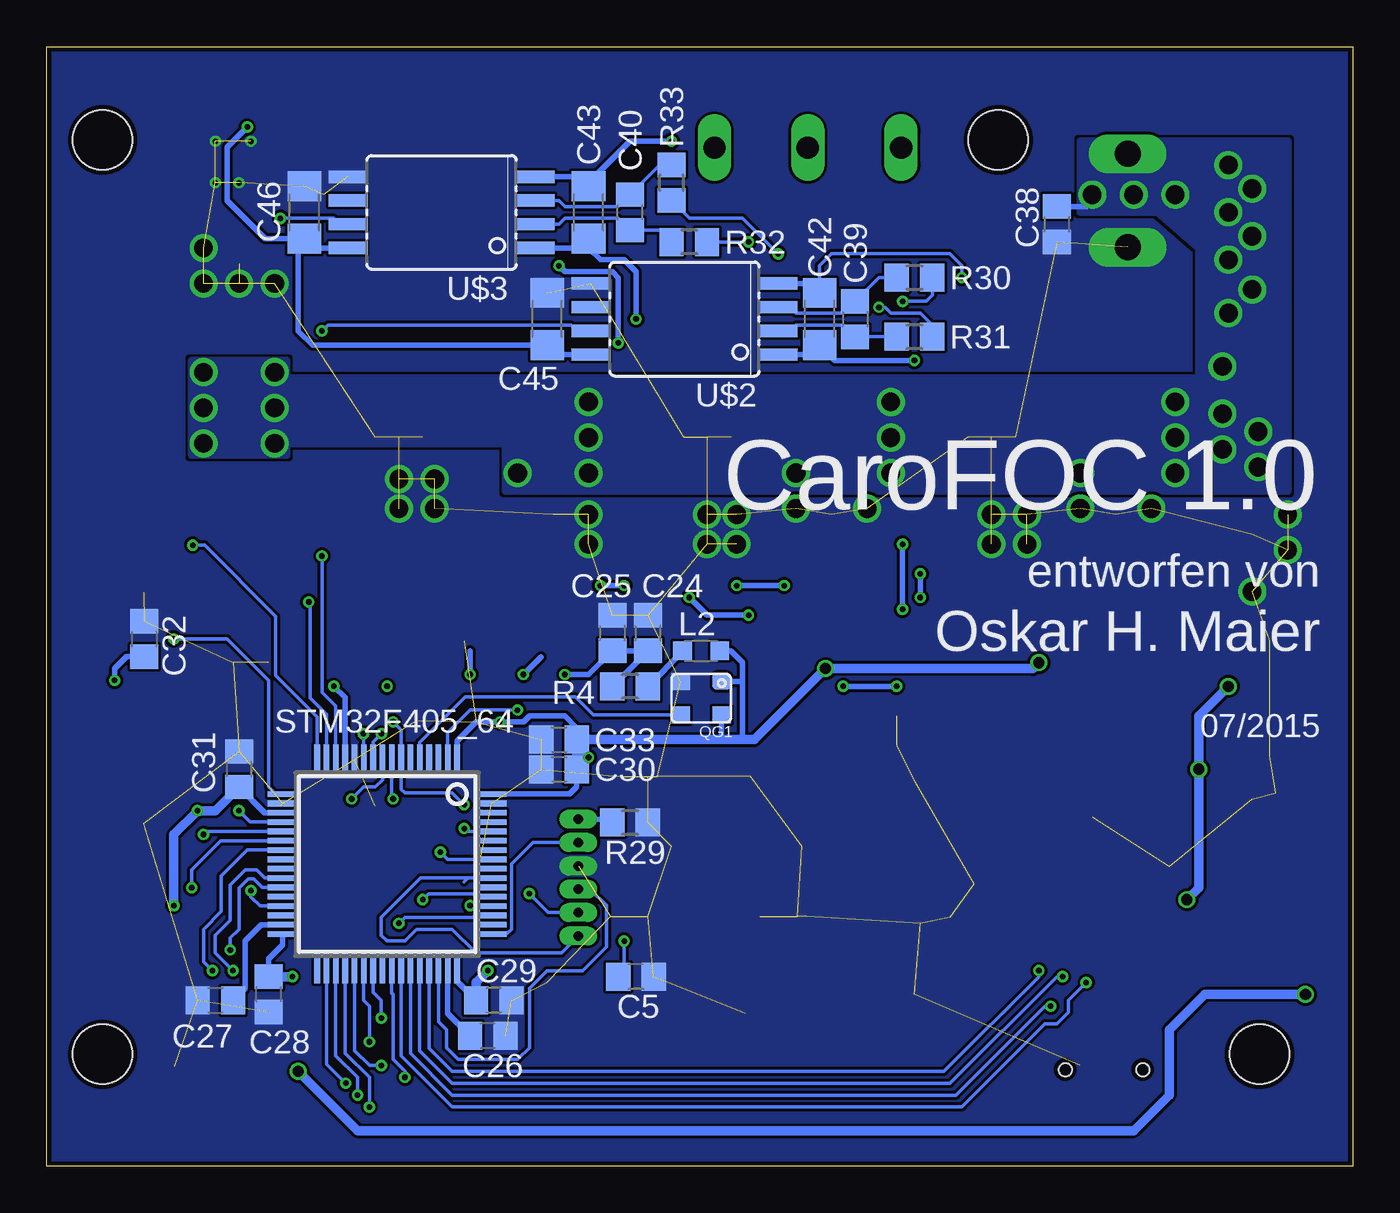
[diagram p6: board, bottom side, seen from below]

Size 70 x 60 mm. Coordinates in mm from the lower left corner, seen from the top.
Outline: 0,0 70,0 70,60 0,60 0,0
Copper layers (1*16): Top 0.035mm / dielectric 1.5mm / Bottom 0.035mm
Design rules "Elecrow_2-layer_eagle_rule *": minimum track width 6mil, minimum drill 0.3mm, track to track 6mil, track to pad 6mil, pad to pad 6mil, via to via 6mil, smd to smd 0mil, copper to edge 10mil, drill to drill 10mil, minimum pad ring 10mil, minimum via ring 6mil, stop-mask expansion 2mil, vias tented up to drill 100mil, thermal gap 10mil
Holes 3.2 mm at 5,6 67,6 67,55 19,55

### Footprints (pad centres in the part's own frame; a part is rotated, then mirrored left to right if it is on the bottom)
MSTBV2 = drill 1.397 long: 1 -2.5,0; 2 2.5,0
C0805 = smd 1.3 x 1.5: 1 -0.95,0; 2 0.95,0
PANASONIC_G = smd 3.9 x 1.6: + 4.25,0; - -4.25,0
C1206 = smd 1.6 x 1.8: 1 -1.4,0; 2 1.4,0
DO-214AC = smd 1.8 x 2.4: A 2.025,0; C -2.025,0
DO214AC = smd 1.8 x 1.7: A 2.05,0; C -2.05,0
53261-05 = smd 0.8 x 2: 1 2.5,-2.5; 2 1.25,-2.5; 3 0,-2.5; 4 -1.25,-2.5; 5 -2.5,-2.5 | smd 2.1 x 3: S1 5,0.625; S2 -5,0.625
CHIP-LED0805 = smd 1.2 x 1.2: A 0,-1.05; C 0,1.05
SOT223 = smd 1.219 x 2.235: 1 -2.311,-3.099; 2 0,-3.099; 3 2.311,-3.099 | smd 3.6 x 2.2: 4 0,3.099
DR127 = smd 3.85 x 5.5: 1 -4.975,0; 2 4.975,0
L2012C = smd 1 x 1: 1 -1,0; 2 1,0
W237-103 = drill 1.194 long: 1 -5,-1.29; 2 0,-1.29; 3 5,-1.29
PG-TDSON-8 = smd 1.3 x 0.75: 1 -2.825,1.905; 2 -2.825,0.635; 3 -2.825,-0.635; 4 -2.825,-1.905; 5 2.825,-1.905; 6 2.825,-0.635; 7 2.825,0.635; 8 2.825,1.905 | smd 4.7 x 4.8: TH 0.725,0
XO32 = smd 1 x 0.9: P$1 -1.1,-0.9; P$2 1.1,-0.9; P$3 1.1,0.9; P$4 -1.1,0.9
R1206 = smd 1.6 x 1.803: 1 -1.422,0; 2 1.422,0
R0805 = smd 1.3 x 1.5: 1 -0.95,0; 2 0.95,0
TACTILE-SWITCH-SMD = smd 1.524 x 0.762: 1 -2.794,1.905; 2 2.794,1.905; 3 -2.794,-1.905; 4 2.794,-1.905
TQFP64 = smd 0.3 x 1.6: 1 -3.75,-5.6; 2 -3.25,-5.6; 3 -2.75,-5.6; 4 -2.25,-5.6; 5 -1.75,-5.6; 6 -1.25,-5.6; 7 -0.75,-5.6; 8 -0.25,-5.6; 9 0.25,-5.6; 10 0.75,-5.6; 11 1.25,-5.6; 12 1.75,-5.6; 13 2.25,-5.6; 14 2.75,-5.6; 15 3.25,-5.6; 16 3.75,-5.6; 33 3.75,5.6; 34 3.25,5.6; 35 2.75,5.6; 36 2.25,5.6; 37 1.75,5.6; 38 1.25,5.6; 39 0.75,5.6; 40 0.25,5.6; 41 -0.25,5.6; 42 -0.75,5.6; 43 -1.25,5.6; 44 -1.75,5.6; 45 -2.25,5.6; 46 -2.75,5.6; 47 -3.25,5.6; 48 -3.75,5.6 | smd 1.6 x 0.3: 17 5.6,-3.75; 18 5.6,-3.25; 19 5.6,-2.75; 20 5.6,-2.25; 21 5.6,-1.75; 22 5.6,-1.25; 23 5.6,-0.75; 24 5.6,-0.25; 25 5.6,0.25; 26 5.6,0.75; 27 5.6,1.25; 28 5.6,1.75; 29 5.6,2.25; 30 5.6,2.75; 31 5.6,3.25; 32 5.6,3.75; 49 -5.6,3.75; 50 -5.6,3.25; 51 -5.6,2.75; 52 -5.6,2.25; 53 -5.6,1.75; 54 -5.6,1.25; 55 -5.6,0.75; 56 -5.6,0.25; 57 -5.6,-0.25; 58 -5.6,-0.75; 59 -5.6,-1.25; 60 -5.6,-1.75; 61 -5.6,-2.25; 62 -5.6,-2.75; 63 -5.6,-3.25; 64 -5.6,-3.75
53047-0610 = drill 0.508 long: 1 3.125,0; 2 1.875,0; 3 0.625,0; 4 -0.625,0; 5 -1.875,0; 6 -3.125,0
HTSSOP56DCA = smd 0.3 x 1.1: 1 -6.75,-3.75; 2 -6.25,-3.75; 3 -5.75,-3.75; 4 -5.25,-3.75; 5 -4.75,-3.75; 6 -4.25,-3.75; 7 -3.75,-3.75; 8 -3.25,-3.75; 9 -2.75,-3.75; 10 -2.25,-3.75; 11 -1.75,-3.75; 12 -1.25,-3.75; 13 -0.75,-3.75; 14 -0.25,-3.75; 15 0.25,-3.75; 16 0.75,-3.75; 17 1.25,-3.75; 18 1.75,-3.75; 19 2.25,-3.75; 20 2.75,-3.75; 21 3.25,-3.75; 22 3.75,-3.75; 23 4.25,-3.75; 24 4.75,-3.75; 25 5.25,-3.75; 26 5.75,-3.75; 27 6.25,-3.75; 28 6.75,-3.75; 29 6.75,3.75; 30 6.25,3.75; 31 5.75,3.75; 32 5.25,3.75; 33 4.75,3.75; 34 4.25,3.75; 35 3.75,3.75; 36 3.25,3.75; 37 2.75,3.75; 38 2.25,3.75; 39 1.75,3.75; 40 1.25,3.75; 41 0.75,3.75; 42 0.25,3.75; 43 -0.25,3.75; 44 -0.75,3.75; 45 -1.25,3.75; 46 -1.75,3.75; 47 -2.25,3.75; 48 -2.75,3.75; 49 -3.25,3.75; 50 -3.75,3.75; 51 -4.25,3.75; 52 -4.75,3.75; 53 -5.25,3.75; 54 -5.75,3.75; 55 -6.25,3.75; 56 -6.75,3.75 | smd 7 x 5.1: EXP@1 -3.5,0; EXP@2 3.5,0
SOIC8 = smd 0.66 x 2.032: 1 -1.905,-5.105; 2 -0.635,-5.105; 3 0.635,-5.105; 4 1.905,-5.105; 5 1.905,4.978; 6 0.635,4.978; 7 -0.635,4.978; 8 -1.905,4.978
629105136821 = smd 0.4 x 1.35: 1 -1.3,0; 2 -0.65,0; 3 0,0; 4 0.65,0; 5 1.3,0 | smd 1.8 x 1.9: Z1 -4,-2.675; Z4 4,-2.675 | smd 1.9 x 1.9: Z2 -1.15,-2.675; Z3 1.15,-2.675 | hole 0.7: -2.075,-0.225; 2.075,-0.225

### Placement (x,y rotation side)
BATTERY  12.07,51.75 90 top
C1  42.23,9.84 180 top
C2  26.45,28.99 135 top
C3  30.7,30.7 135 top
C4  37.05,29.94 45 top
C5  38.42,10.16 180 bottom
C6  36.83,6.99 135 top
C7  33.24,7.53 135 top
C8  27.94,24.13 90 top
C9  24.45,20.64 0 top
C10  24.45,9.21 0 top
C11  21.59,12.38 270 top
C14  5.4,38.1 90 top
C15  59.69,44.13 270 top
C17  12.7,35.88 270 top
C18  27.94,35.88 270 top
C19  42.86,35.88 270 top
C20  25.4,24.13 180 top
C21  25.4,22.54 180 top
C22  3.18,20 0 top
C23  6.35,19.68 180 top
C24  37.78,28.57 270 bottom
C25  39.69,28.57 270 bottom
C26  46.35,6.99 180 bottom
C27  60.96,8.89 0 bottom
C28  58.1,9.21 90 bottom
C29  46.04,8.89 180 bottom
C30  42.55,21.27 0 bottom
C31  59.69,21.27 270 bottom
C32  64.77,28.26 270 bottom
C33  42.55,22.86 0 bottom
C37  47.94,23.81 180 top
C38  15.88,50.48 270 bottom
C39  26.67,45.4 270 bottom
C40  38.73,51.12 90 bottom
C41  40.01,53.97 90 top
C42  28.58,45.4 90 bottom
C43  40.96,51.12 90 bottom
C44  42.23,53.97 270 top
C45  43.18,45.4 90 bottom
C46  56.2,51.12 90 bottom
C47  57.47,53.97 270 top
C48  9.84,17.46 270 top
D1  20.32,17.14 270 top
D2  2.54,12.7 270 top
D3  4.45,17.14 0 top
D4  4.76,12.7 270 top
ENC_ABI  67.31,28.26 270 top
ENCODER_SPI  67.31,15.88 270 top
ERROR  47.62,29.21 180 top
IC1  4.45,25.08 0 top
L1  14.92,26.35 180 top
L2  34.92,27.62 0 bottom
LED1  60.64,22.54 0 top
LED2  57.47,22.54 0 top
MASTER_SPI  60.64,2.86 180 top
MOTOR  29.21,55.88 0 top
Q1  13.65,41.91 270 top
Q2  20,41.91 90 top
Q3  28.89,41.91 270 top
Q4  35.24,41.91 90 top
Q5  44.77,41.91 270 top
Q6  51.75,41.91 90 top
QG1  34.92,25.08 180 bottom
R1  24.45,47.62 180 top
R2  31.12,47.62 0 top
R3  36.51,35.88 90 top
R4  38.73,25.72 180 bottom
R5  24.13,13.02 0 top
R6  26.99,3.81 180 top
R7  29.53,4.13 270 top
R8  26.35,5.71 180 top
R9  13.97,17.78 270 top
R10  12.07,17.78 90 top
R11  24.13,11.11 0 top
R12  21.59,35.56 90 top
R13  9.52,44.13 90 top
R14  24.77,43.81 90 top
R15  37.78,48.58 270 top
R16  53.34,35.56 90 top
R17  40.64,43.81 90 top
R24  46.99,16.19 270 top
R25  47.62,21.91 180 top
R26  45.72,29.21 270 top
R27  60.01,26.04 270 top
R28  58.1,26.04 270 top
R29  38.73,18.42 180 bottom
R30  23.49,47.62 180 bottom
R31  23.49,44.45 180 bottom
R32  35.56,49.53 180 bottom
R33  36.51,52.7 90 bottom
R34  40.32,49.53 90 top
R35  38.01,54.39 90 top
RESET  52.07,26.67 90 top
STM32F405_64  51.75,16.19 180 bottom
SW1  50.48,16.51 270 top
SW2  55.56,16.51 270 top
SWD  41.5,15.46 90 top
U$1  33.02,17.14 0 top
U$2  35.88,45.4 90 bottom
U$3  48.89,51.12 90 bottom
U$4  50.17,53.97 270 top
USB  13.34,5.4 0 top

### Tracks (layer width: path | path; a pad name or v marks a point on that pad's centre or on a via)
!FAULT
  Top 0.2: U$1.6 28.77,6.16 29.53,5.4 R7.1
!OCTW
  Top 0.2: U$1.5 28.27,4.14 R6.1
+3V3  (via drill 0.3, 0.6)
  Top 0.2: v45.72,23.81 45.72,22.22 46.04,21.91 R25.2
  Top 0.3: U$1.49 29.77,25.47 28.58,26.67 v28.26,26.67 | ENC_ABI.1 66.08,25.76 v66.36,26.03 | SWD.1 43.05,18.59 43.18,18.72
  Top 0.5: IC1.3 6.76,20.23 C23.1 8.25,20.64 v8.25,21.27 | v16.83,26.99 15.56,26.99 12.38,30.16 7.62,30.16 6.98,29.53 6.98,26.03 v6.67,25.72 | R7.2 29.53,2.86 29.21,2.54 26.67,2.54 26.04,3.17 R6.2 26.04,5.08 R8.2 24.77,6.35 22.86,6.35 14.92,14.29 v8.89,14.29 | v56.83,10.16 46.67,10.16 v46.35,10.48 43.18,13.65 43.18,18.72 43.18,20.96 42.23,21.91 v40.96,21.91 | ENC_ABI.1 64.81,20.68 63.18,19.05 v61.91,19.05 61.28,19.05 60.33,18.1 56.83,18.1 54.29,20.64 47.31,20.64 46.67,21.27 R25.2 | ENCODER_SPI.1 63.78,13.38 v63.18,13.97
  Bottom 0.3: STM32F405_64.64 41.97,19.94 41.59,20.32 C30.2 | STM32F405_64.48 48,9.91 C29.2 | STM32F405_64.19 58.31,18.94 C31.2 | QG1.P$4 33.83,23.01 33.97,22.86 | L2.2 33.34,27.62 32.7,26.99 32.7,26.03 32.76,25.98 | 32.7,22.86 32.7,25.93 32.76,25.98 | 48,22.48 STM32F405_64.1 48,22.8 46.99,23.81 v45.72,23.81 44.45,23.81 44.13,24.13 42.23,24.13 41.59,23.49 C33.2 | v66.36,26.03 66.36,26.67 65.72,27.31 C32.2 | STM32F405_64.32 57.35,11.86 58.1,11.11 C28.2 | v56.83,10.16 | QG1.P$1 32.76,25.98 | SWD.1 39.86,18.59 R29.2
  Bottom 0.5: v6.67,25.72 8.25,24.13 v8.25,21.27 8.25,14.92 v8.89,14.29 | 41.59,21.91 C33.2 33.97,22.86 32.7,22.86 32.07,22.86 v28.26,26.67 17.15,26.67 v16.83,26.99 | 41.59,21.91 C30.2 | C28.2 v56.83,10.16 | C29.2 46.99,9.85 v46.35,10.48 | v40.96,21.91 41.59,21.91 | C31.2 60.96,19.05 v61.91,19.05 63.18,17.78 v63.18,13.97
+5V/1
  Top 0.3: C48.1 11.93,18.86 R10.2 | L1.2 9.84,26.25
  Top 0.5: D3.A 8.12,17.14 C48.1 9.84,26.25
+5V/2  (via drill 0.6)
  Top 0.5: MASTER_SPI.1 56.79,5.36 v56.52,5.08 | v2.54,9.21 D2.A
  Bottom 0.5: v56.52,5.08 53.34,1.9 11.75,1.9 9.84,3.81 9.84,7.3 7.94,9.21 v2.54,9.21
+12V  (via drill 1 pad 1.27)
  Top 0.3: U$1.29 39.77,23.1
  Top 0.5: C21.1 C20.1 26.35,25.72 21.59,30.48 16.51,30.48 14.61,32.39 10.8,32.39 6.98,36.2 | v57.78,38.74 57.78,33.66 55.88,31.75 44.13,31.75 39.77,27.39 39.77,23.1
  Bottom 0.3: C38.1 14.29,51.43 v13.97,52.07
  other vias: 14.61,37.15 9.52,37.15 29.84,37.15 24.77,37.15 44.77,37.15 40.96,37.15 40.96,40.96 40.96,39.05 24.77,39.05 24.77,40.96 9.52,39.05 9.52,40.96 11.75,52.07 9.52,52.07 61.59,38.73 61.59,40.64 57.78,40.64 5.08,39.37 6.98,40.32 61.59,42.55 57.78,42.55 5.4,52.39 6.67,53.66 5.4,49.85 6.67,51.12 6.67,48.58 5.4,46.99 6.98,42.86 6.67,45.72 5.08,37.47 6.98,38.42
  pour Top (no thermals): 8.57,41.59 16.19,41.59 16.19,36.51 8.57,36.51
  pour Top (no thermals): 24.13,41.59 31.43,41.59 31.43,36.51 24.13,36.51
  pour Top (no thermals): 40.01,41.59 47.94,41.59 47.94,36.51 40.01,36.51
  pour Top (rank 2, no thermals): 14.61,55.25 3.49,55.25 3.49,36.2 8.25,36.2 8.25,49.53 10.48,51.44 14.61,51.44
  pour Bottom (no thermals): 14.61,51.12 10.48,51.12 8.25,49.21 8.25,42.23 57.15,42.23 57.15,43.18 62.23,43.18 62.23,38.1 57.15,38.1 57.15,38.73 45.4,38.73 45.4,36.2 3.49,36.2 3.49,54.93 14.61,54.93
  pour Top (no thermals): 57.15,43.18 62.23,43.18 62.23,38.1 57.15,38.1
  pour Top (rank 2, no thermals): 26.99,20.32 28.26,20.32 28.26,22.54 26.03,22.54 26.03,21.59 26.99,21.59
BST_A  (via drill 0.3)
  Top 0.3: U$1.48 30.27,25.93 27.88,28.31 C2.1 26.74,27.94 25.72,27.94 24.13,29.53 v24.13,29.85 | v23.49,43.18 22.86,42.55 22.86,35.88 24.13,34.61 v24.13,33.34
  Bottom 0.3: U$2.1 29.08,43.5 C42.1 27.75,43.18 v23.49,43.18 | v24.13,33.34 v24.13,29.85
BST_B  (via drill 0.3)
  Top 0.3: U$1.43 32.77,28.64 32.13,29.28 | C3.1 32.13,29.28 | v32.38,29.53 | v32.38,29.53 32.13,29.28 | v38.42,45.4 38.42,33.66 37.47,32.7 37.15,32.7 35.56,31.11 v35.56,30.48
  Bottom 0.3: U$3.1 41.46,49.21 C43.1 40.96,49.21 40.32,48.58 39.05,48.58 38.42,47.94 v38.42,45.4 | v32.38,29.53 34.61,29.53 v35.56,30.48
BST_C  (via drill 0.3)
  Top 0.3: U$1.38 35.27,28.15 C4.1 36.38,30.99 37.47,32.07 37.78,32.07 39.05,33.34 39.05,43.82 v39.37,44.13 | U$4.1 42.73,55.88 C44.1 42.23,56.2 42.55,56.52 46.35,56.52 46.67,56.2 46.67,51.44 46.35,51.12 42.55,51.12 42.23,50.8 42.23,48.58 v42.55,48.26
  Bottom 0.3: v42.55,48.26 42.23,47.94 39.69,47.94 39.37,47.63 v39.37,44.13
EN_GATE  (via drill 0.3)
  Top 0.2: U$1.16 33.77,11.63 40.64,4.76 v50.8,4.76
  Bottom 0.2: STM32F405_64.41 51.5,9.28 51.44,9.21 51.44,5.71 50.8,5.08 v50.8,4.76
ENC_A  (via drill 0.3)
  Top 0.2: v59.06,14.76 61.12,14.76 63.82,12.07 66.04,12.07 66.67,12.7 66.67,18.42 65.72,19.37 65.72,24.45 66.36,25.08 66.99,25.08 67.31,25.4 67.31,26.67 66.97,27.01 ENC_ABI.2
  Bottom 0.2: STM32F405_64.29 58.55,13.94 59.06,14.45 v59.06,14.76
ENC_B  (via drill 0.3)
  Top 0.2: v63.18,28.26 ENC_ABI.3
  Bottom 0.2: STM32F405_64.17 57.72,19.94 58.1,20.32 58.1,26.03 60.33,28.26 v63.18,28.26
ENC_I  (via drill 0.3)
  Top 0.2: ENC_ABI.4 64.79,29.53 63.5,29.53 62.55,28.57 62.55,20.96 61.28,19.68 60.96,19.68 60.33,19.05 v59.69,19.05
  Bottom 0.2: STM32F405_64.20 59.08,18.44 v59.69,19.05
ENC_MISO  (via drill 0.3)
  Top 0.2: ENCODER_SPI.2 64.79,14.6 64.14,14.6 63.82,14.92 v62.23,14.92
  Bottom 0.2: STM32F405_64.22 60.66,17.44 62.23,15.88 v62.23,14.92
ENC_MOSI  (via drill 0.3)
  Top 0.2: ENCODER_SPI.3 62.55,15.88 61.59,16.83 v48.89,16.83
  Bottom 0.2: STM32F405_64.57 48.51,16.44 v48.89,16.83
ENC_SCLK  (via drill 0.3)
  Top 0.2: v61.59,17.78 62.25,17.13 ENCODER_SPI.4
  Bottom 0.2: STM32F405_64.21 61.43,17.94 v61.59,17.78
GD_MISO  (via drill 0.3)
  Top 0.2: U$1.10 30.77,7.01 34.92,2.86 51.44,2.86 52.39,3.81 v53.34,3.81
  Bottom 0.2: STM32F405_64.35 54.5,5.92 53.34,4.76 v53.34,3.81
GD_MOSI  (via drill 0.3)
  Top 0.2: U$1.9 30.27,6.88 34.92,2.22 51.75,2.22 v52.7,3.17
  Bottom 0.2: STM32F405_64.36 54,6.06 52.7,4.76 v52.7,3.17
GD_SCLK  (via drill 0.3)
  Top 0.2: U$1.11 31.27,7.15 34.92,3.49 51.44,3.49 52.39,4.45 v53.97,4.45
  Bottom 0.2: STM32F405_64.34 55,5.47 v53.97,4.45
GH_A
  Top 0.3: U$1.47 30.77,26.38 26.03,31.11 16.83,31.11 14.92,33.02 11.11,33.02 8.25,35.88 8.25,42.23 9.21,43.18 R13.1
GH_B
  Top 0.3: U$1.42 33.27,29.91 29.21,33.97 25.72,33.97 23.49,36.2 23.49,42.23 24.13,42.86 R14.1
GH_C
  Top 0.3: U$1.37 35.77,26.88 39.69,30.8 39.69,42.55 40.01,42.86 R17.1
GL_A
  Top 0.3: R12.1 21.59,33.34 22.54,32.39 26.67,32.39 31.77,27.28 U$1.45
GL_B
  Top 0.3: U$1.40 34.27,31.41 36.51,33.66 R3.1
GL_C
  Top 0.3: U$1.35 36.77,25.97 44.13,33.34 46.04,33.34 46.67,33.97 53.18,33.97 R16.1
GND  (via drill 0.3, 1)  (108 unrouted)
  other vias: 10.8,35.24 14.61,35.24 26.03,35.24 29.84,35.24 40.96,34.92 40.96,33.34 17.46,34.92 19.37,34.92 19.37,33.34 17.46,33.34 33.02,34.92 34.61,34.92 34.61,33.34 33.02,33.34 49.21,36.83 51.12,36.83 51.12,35.24 49.21,35.24 5.4,30.8 3.49,33.02 3.49,34.92 57.78,47.31 59.69,47.31 61.59,49.21 61.59,47.31 59.06,54.93 60.96,54.93 59.69,52.7 60.96,52.7
  pour Bottom (rank 3, no thermals): 0,60.01 70.17,60.01 70.17,0 0,0
  pour Top (rank 3, no thermals): 0,60.01 70.17,60.01 70.17,0 0,0
H_A  (via drill 0.3)
  Top 0.2: U$1.17 34.27,11.77 40.64,5.4 v52.07,5.4
  Bottom 0.2: STM32F405_64.37 53.5,6.2 52.7,5.4 v52.07,5.4
H_B  (via drill 0.3)
  Top 0.2: U$1.19 35.27,12.04 40.64,6.67 v52.7,6.67
  Bottom 0.2: STM32F405_64.38 53.02,10.57 53.02,8.89 52.7,8.57 v52.7,6.67
H_C  (via drill 0.3)
  Top 0.2: U$1.21 36.27,12.31 40.64,7.94 v52.07,7.94
  Bottom 0.2: STM32F405_64.39 52.5,9.32 52.07,8.89 v52.07,7.94
I_A  (via drill 0.3)
  Top 0.2: v55.25,44.77 v55.25,32.7
  Bottom 0.2: U$2.7 41.59,44.77 41.91,45.08 54.93,45.08 v55.25,44.77 | STM32F405_64.14 54.5,24.66 55.25,25.4 v55.25,32.7
I_B  (via drill 0.3)
  Top 0.2: v57.47,50.8 63.18,50.8 63.5,50.48 63.5,37.47 56.27,30.24 v55.95,30.24
  Bottom 0.2: U$3.7 54.29,50.48 54.61,50.8 v57.47,50.8 | STM32F405_64.15 55,24.21 55.88,25.08 55.88,30.16 v55.95,30.24
I_C  (via drill 0.3)
  Top 0.2: U$4.7 55.88,54.61 56.2,54.29 62.55,54.29 65.41,51.44 65.41,36.51 v62.17,33.28
  Bottom 0.2: STM32F405_64.16 55.5,24.07 57.72,26.29 57.72,29.47 61.53,33.28 v62.17,33.28
L_A  (via drill 0.3)
  Top 0.2: U$1.18 34.77,11.9 40.64,6.03 53.34,6.03 54.61,7.3 57.94,7.3 v61.12,10.48
  Bottom 0.2: STM32F405_64.23 59.26,16.94 60.64,15.56 60.64,13.65 61.59,12.7 61.59,10.95 v61.12,10.48
L_B  (via drill 0.3)
  Top 0.2: U$1.20 35.77,12.17 40.64,7.3 53.66,7.3 54.29,7.94 57.47,7.94 v60.01,10.48
  Bottom 0.2: v60.01,10.48 60.96,11.43 60.96,12.38 60.17,13.18 60.17,15.08 59.37,15.88 58.74,15.88 58.31,15.44 STM32F405_64.26
L_C  (via drill 0.3)
  Top 0.2: U$1.22 36.77,12.44 40.64,8.57 57.15,8.57 v60.17,11.59
  Bottom 0.2: v60.17,11.59 60.17,12.22 59.69,12.7 59.69,14.92 59.21,15.4 58.9,15.4 58.44,14.94 STM32F405_64.27
LED1  (via drill 0.3)
  Top 0.2: LED1.A 59.47,20.32 55.88,20.32 54.29,21.91 53.34,21.91 v52.07,23.18
  Bottom 0.2: STM32F405_64.10 52.5,22.74 v52.07,23.18
LED2  (via drill 0.3)
  Top 0.2: v53.02,23.18 53.34,22.86 56.1,22.86 LED2.A
  Bottom 0.2: v53.02,23.18 53,23.16 STM32F405_64.11
LED_ERROR  (via drill 0.3)
  Top 0.2: v44.77,24.45 42.23,24.45 40.96,25.72 40.96,26.99 42.23,28.26 R26.2
  Bottom 0.2: STM32F405_64.2 48.5,23.25 47.31,24.45 v44.77,24.45
MSTR_MISO  (via drill 0.3)
  Top 0.2: MASTER_SPI.2 59.39,7.32 62.23,10.16 62.23,10.79 60.33,12.7 60.01,12.7 58.74,11.43 48.89,11.43 47.31,13.02 v47.31,13.97
  Bottom 0.2: STM32F405_64.52 47.28,13.94 v47.31,13.97
MSTR_MOSI  (via drill 0.3)
  Top 0.2: MASTER_SPI.3 60.64,7.62 62.86,9.84 62.86,11.11 60.64,13.34 59.69,13.34 58.42,12.07 50.8,12.07 49.85,13.02 v49.85,14.29
  Bottom 0.2: STM32F405_64.53 46.99,14.44 47.15,14.6 49.53,14.6 v49.85,14.29
MSTR_SCLK  (via drill 0.3)
  Top 0.2: MASTER_SPI.4 61.89,7.92 63.5,9.53 63.5,11.43 60.96,13.97 59.37,13.97 58.1,12.7 51.44,12.7 v51.12,13.02
  Bottom 0.2: STM32F405_64.51 47.04,13.44 47.15,13.34 50.8,13.34 v51.12,13.02
N$1
  Bottom 0.3: L2.1 35.92,27.58 R4.1
N$3
  Bottom 0.3: STM32F405_64.47 48.5,8.18 C26.2
N$4
  Bottom 0.3: STM32F405_64.31 58.5,12.94 59.37,12.07 59.37,9.53 C27.2
N$6
  Top 0.3: Q3.4 24.8,44.74 R14.2
N$7
  Top 0.2: R27.2 60.64,24.45 LED1.C
N$8
  Top 0.3: 2.22,22.07 IC1.1 | 2.13,20.09 C22.1
  Top 0.5: IC1.1 2.13,20.09 | C22.1 2.39,19.83 D3.C 2.39,14.89 D2.C D4.C
N$9
  Top 0.2: U$1.1 25.46,13.39 R5.2
N$10
  Top 0.2: U$1.23 37.27,12.58 40.01,9.84 C1.2
N$11  (via drill 0.3)
  Top 0.2: U$1.27 39.27,12.28 v39.05,12.07
  Bottom 0.2: v39.05,12.07 39.05,10.47 C5.2
N$12
  Top 0.2: U$1.14 32.77,11.36 34.61,9.53 34.61,7.62 36.2,6.03 37.22,6.03 C6.1
N$13
  Top 0.2: U$1.15 33.27,11.5 35.24,9.53 35.24,8.57 C6.2
N$14
  Top 0.2: U$1.13 32.27,11.23 33.97,9.53 33.97,6.91 C7.1
N$15
  Top 0.3: U$1.52 28.26,20.91 28.26,22.86 C8.1
N$16  (via drill 0.3)
  Top 0.3: U$1.51 28.77,21.47 29.21,21.91 | U$1.50 29.27,21.85 29.21,21.91 | 29.21,21.91 29.21,23.81 C8.2 v27.3,25.72 | v24.45,25.72 20.53,25.72 L1.1
  Top 0.5: D1.C 19.9,19.59 L1.1
  Bottom 0.3: v27.3,25.72 v24.45,25.72
N$17
  Top 0.3: U$1.56 25.66,20.89 C9.2
N$18
  Top 0.3: R10.1 R9.2 13.97,16.19 23.18,6.99 26.99,6.99 27.27,7.27 U$1.3
N$19
  Top 0.2: R11.1 21.91,11.11 C11.2
N$20
  Top 0.2: U$1.2 26.77,11.85 26.03,11.11 R11.2 25.08,9.53 C10.2
N$21
  Top 0.3: Q1.4 9.87,44.74 R13.2
N$22
  Top 0.3: R3.2 37.15,37.93 Q4.4
N$24
  Top 0.3: Q5.4 40.67,44.74 R17.2
N$25
  Top 0.3: R16.2 53.66,37.3 Q6.4
N$26
  Top 0.3: R12.2 21.91,37.3 Q2.4
N$27
  Bottom 0.2: U$2.3 30.16,46.04 29.84,45.72 27.3,45.72 C39.1 25.4,47.63 R30.2
N$28
  Top 0.2: R28.2 57.47,24.45 LED2.C
N$30
  Bottom 0.2: STM32F405_64.5 50,22.71 47.57,25.14 41.65,25.14 40.69,24.18 QG1.P$3
N$31  (via drill 0.3)
  Top 0.2: v47.62,18.1 47.62,17.78 R24.1
  Bottom 0.2: STM32F405_64.60 47.47,17.94 v47.62,18.1
N$32
  Bottom 0.2: U$2.2 30.16,44.77 29.84,45.08 27.3,45.08 C39.2 R31.2
N$33
  Top 0.3: R26.1 47.52,30.16 ERROR.A
N$37
  Bottom 0.2: R33.2 37.15,53.66 C40.2 39.37,51.44 42.23,51.44 42.55,51.75 U$3.3
N$38
  Bottom 0.2: R32.2 37.15,50.17 C40.1 39.37,50.8 42.23,50.8 42.55,50.48 U$3.2
N$39
  Top 0.2: U$4.3 43.81,53.34 43.5,53.66 40.64,53.66 C41.1 40.01,50.8 R34.2
N$40
  Top 0.2: R35.2 39.59,55.34 C41.2 40.64,54.29 43.5,54.29 43.81,54.61 U$4.2
PWRGD
  Top 0.2: U$1.4 27.77,6.18 R8.1
RESET  (via drill 0.3)
  Top 0.2: RESET.3 53.91,23.81 v51.44,23.81 51.12,23.49 51.12,22.22 50.8,21.91 R25.1 48.58,23.49 C37.1 | v44.13,14.6 44.13,16.83 46.67,19.37 v47.62,19.37
  Bottom 0.2: v51.44,23.81 51,23.38 STM32F405_64.7 51,20.21 50.8,20 48.26,20 v47.62,19.37 | SWD.5 43.12,13.59 v44.13,14.6
SH_A  (via drill 0.3)
  Top 0.2: R1.2 23.81,47.63 24.13,47.31 v24.13,46.36
  Top 0.3: Q2.8 16.83,44.74 16.83,38.1 16.19,37.47 16.19,32.7 17.15,31.75 v23.18,31.75 26.35,31.75 31.27,26.83 U$1.46 | C2.2 24.95,30.48 v23.18,30.48
  Top 1: Q2.6 20.64,43.27 Q2.TH
  Bottom 0.2: v24.13,46.36 22.86,46.36 22.54,46.67 22.54,47.46 22.71,47.63 R30.1 | C42.2 28.58,48.26 27.94,48.89 21.59,48.89 20.95,48.26 v20.95,47.63
  Bottom 0.3: C42.2 29.08,47.31 U$2.4 | v23.18,30.48 v23.18,31.75
  pour Top (isolate 0.254, no thermals): 12.7,44.13 12.7,46.04 18.1,46.04 20.95,48.89 23.18,48.89 23.18,44.13
SH_B  (via drill 0.3)
  Top 0.2: v32.38,49.53 32.07,49.53 31.43,48.89 31.43,47.94 31.75,47.63 R2.2
  Top 0.3: Q4.8 32.07,44.74 32.07,38.1 31.43,37.47 31.43,32.7 v33.02,31.11 33.77,30.36 U$1.41 | 33.34,48.89 33.34,49.53 31.75,51.12 31.75,56.52 32.07,56.83 36.2,56.83 36.51,56.52 v36.51,54.93 | C3.2 30.22,31.38 v30.48,31.11
  Top 1: Q4.6 35.88,43.27 Q4.TH
  Bottom 0.2: R32.1 v32.38,49.53
  Bottom 0.3: U$3.4 41.46,53.02 C43.2 40.96,52.71 38.73,54.93 v36.51,54.93 | v30.48,31.11 v33.02,31.11
  pour Top (no thermals): 27.94,44.13 27.94,46.36 32.07,46.36 32.07,48.89 35.24,48.89 35.24,47.31 37.78,44.77 37.78,44.13
SH_C  (via drill 0.3)
  Top 0.2: R15.2 37.78,47.94 38.1,48.26 39.05,48.26 39.37,48.58 R34.1
  Top 0.3: U$1.36 36.27,26.43 40.64,30.8 | Q6.8 48.58,44.74 48.58,38.1 47.94,37.47 47.94,36.2 45.72,33.97 43.81,33.97 40.64,30.8 | U$4.4 42.73,52.07 C44.2 41.59,51.94 41.59,47.63 | C4.2 38.23,31.11 v39.05,31.11 | v40.32,31.11 40.64,30.8
  Top 1: Q6.6 52.39,43.27 Q6.TH
  Bottom 0.3: v39.05,31.11 v40.32,31.11
  pour Top (no thermals): 43.81,44.13 43.81,45.72 37.47,45.72 36.2,46.99 36.2,47.62 54.29,47.62 54.29,44.13
SW1  (via drill 0.3)
  Top 0.2: SW1.3 51.05,19.3 v51.44,19.68
  Bottom 0.2: STM32F405_64.8 51.5,19.75 v51.44,19.68
SW2  (via drill 0.3)
  Top 0.2: SW2.3 v53.66,19.68
  Bottom 0.2: STM32F405_64.9 52,20.71 52.39,20.32 53.02,20.32 v53.66,19.68
SWCLK
  Bottom 0.2: SWD.2 43.94,17.34 45.09,16.19 45.09,12.7 45.34,12.44 STM32F405_64.49
SWDIO
  Bottom 0.2: STM32F405_64.46 49,7.73 48.58,7.3 48.58,6.35 47.94,5.71 44.77,5.71 44.13,6.35 44.13,9.53 43.18,10.48 41.27,10.48 40.01,11.75 40.01,13.97 40.88,14.84 SWD.4
SWO
  Bottom 0.2: 47.62,15.24 47.42,15.44 STM32F405_64.55 49.96,15.44 52.07,13.34 52.07,12.38 51.75,12.07 50.8,12.07 50.17,12.7 48.26,12.7 46.99,11.43 42.41,11.43 SWD.6
U_A  (via drill 0.3)
  Top 0.2: 25.72,47.63 25.08,47.63 24.77,47.31 24.77,46.67 v25.4,46.04
  Bottom 0.2: v25.4,46.04 25.08,46.04 24.77,45.72 23.18,45.72 22.54,45.08 R31.1
  pour Top (no thermals): 21.91,56.83 21.91,49.21 25.4,49.21 25.4,46.67 27.62,46.67 27.62,56.83
U_B  (via drill 0.3)
  Top 0.2: v30.8,48.89 30.8,47.94 30.48,47.63 R2.1
  Bottom 0.2: v30.8,48.89 32.7,50.8 35.56,50.8 R33.1
  pour Top (no thermals): 27.94,46.67 30.16,46.67 30.16,49.53 31.43,49.53 31.43,56.83 27.94,56.83
U_C
  Top 0.2: R15.1 37.78,49.21 38.1,48.89 38.73,48.89 39.05,49.21 39.05,51.44 38.1,52.39 38.1,53.34 R35.1
  pour Top (no thermals): 31.75,49.53 38.73,49.53 38.73,50.8 36.51,53.02 36.51,56.83 31.75,56.83
USB_DM  (via drill 0.3)
  Top 0.2: USB.2 12.68,7.29 v15.56,10.16
  Bottom 0.2: STM32F405_64.44 50,6.19 48.26,4.45 21.59,4.45 15.88,10.16 v15.56,10.16
USB_DP  (via drill 0.3)
  Top 0.2: USB.3 13.34,6.99 v16.83,10.48
  Bottom 0.2: STM32F405_64.45 49.5,6.32 48.26,5.08 21.91,5.08 16.83,10.16 v16.83,10.48
USB_ID  (via drill 0.3)
  Top 0.2: USB.4 13.98,6.36 v16.19,8.57
  Bottom 0.2: STM32F405_64.43 50.5,6.05 48.26,3.81 21.27,3.81 16.51,8.57 v16.19,8.57
USB_VBUS  (via drill 0.3)
  Top 0.2: 12.04,7.59 v14.29,9.84
  Top 0.5: USB.1 12.04,7.59 8.98,10.65 D4.A
  Bottom 0.2: STM32F405_64.42 51,5.92 48.26,3.17 20.95,3.17 16.51,7.62 15.88,7.62 15.24,8.25 15.24,8.89 v14.29,9.84
VREF  (via drill 0.3)
  Top 0.3: U$4.8 56.96,55.88 C47.1 57.78,55.69 v59.24,55.69 62.1,55.69 66.36,51.44 66.36,36.51 63.18,33.34 63.18,33.02 62.55,32.39 61.28,32.39 v54.61,25.72 v51.75,25.72 50.8,25.72 50.48,25.4 49.21,25.4 48.26,26.35 v47.31,26.35 v44.45,26.35 v42.23,26.35
  Bottom 0.3: U$2.8 42.67,43.5 C45.1 55.75,44 56.52,44.77 56.52,49.4 C46.1 | U$3.8 55.69,49.21 C46.1 | C25.2 C24.2 R4.2 | C25.2 | STM32F405_64.13 54,25.11 v54.61,25.72 | 47.31,27.62 v47.31,26.35 | C25.2 40.96,26.35 v42.23,26.35 | 43.5,27.3 v44.45,26.35 | v59.24,55.69 60.33,54.61 60.33,51.75 58.29,49.72 C46.1

### Text on the board
bNames: CaroFOC 1.0 | entworfen von | Oskar H. Maier | 07/2015